# EAGLE design Thermister Expansion Module (EAGLE 9.6.2)

## Sheet 1 of 2
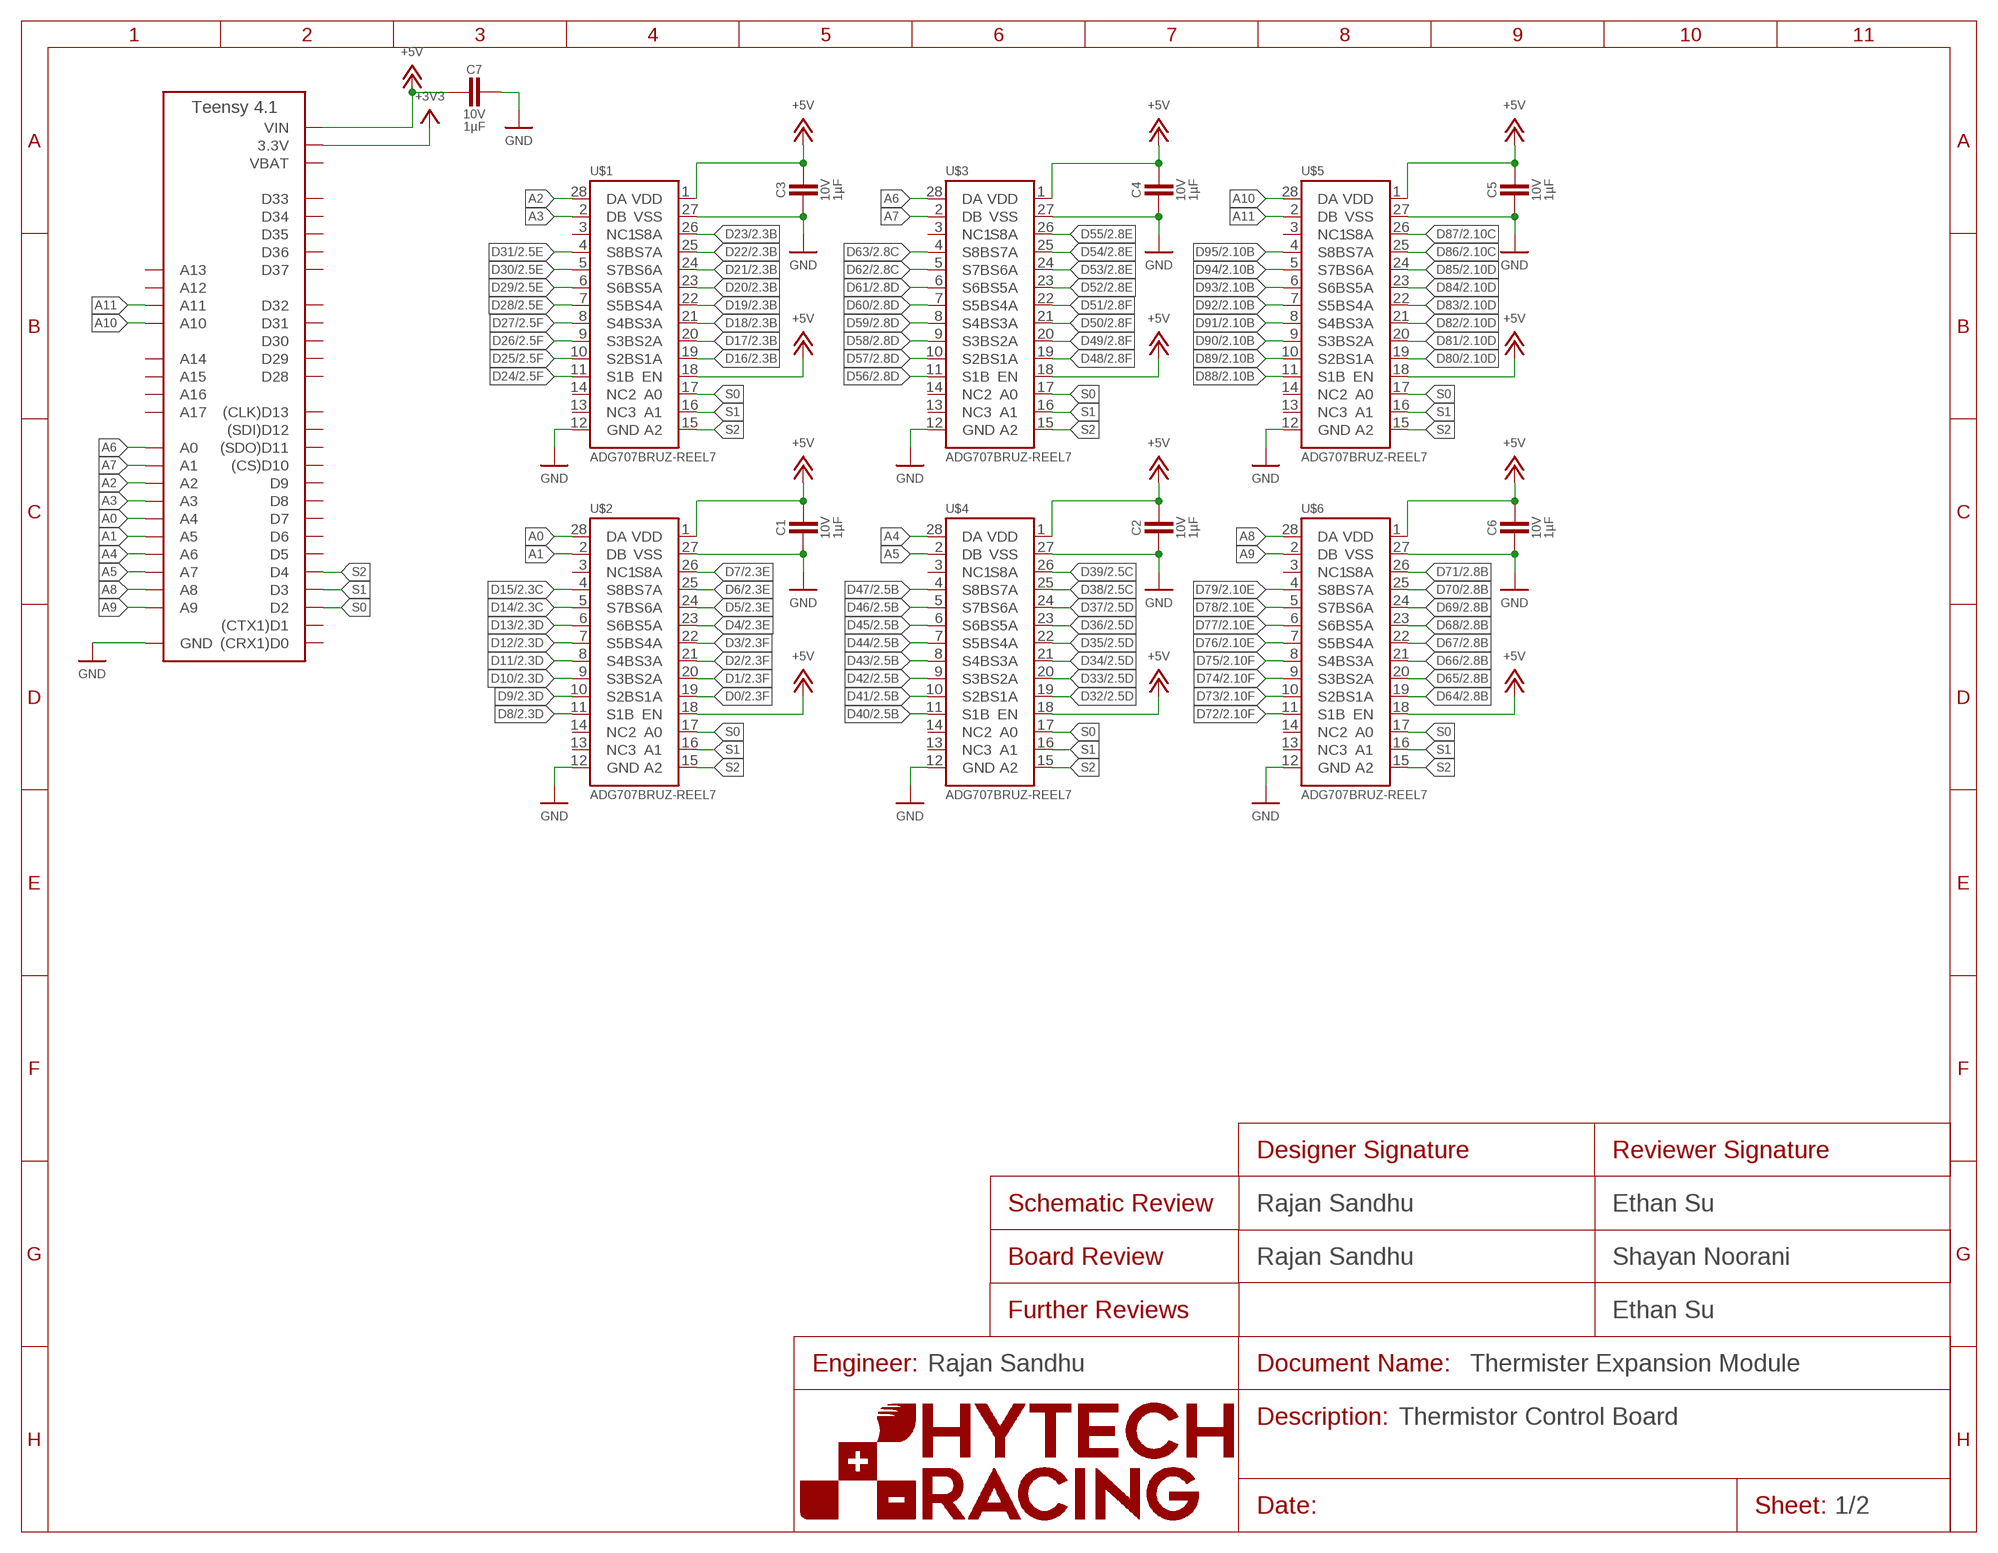
[diagram p0: schematic, sheet 1]
FRAME1 (FRAME): DESCRIPTION_1: Thermistor Control Board; DESIGNER_BOARD: Rajan Sandhu; DESIGNER_SCHEMATIC: Rajan Sandhu; ENGINEER: Rajan Sandhu; REVIEWER_BOARD: Shayan Noorani; REVIEWER_FURTHER: Ethan Su; REVIEWER_SCHEMATIC: Ethan Su

### Parts
A1  TEENSY_4.1  [TEENSY_LONG_EXT]
C1  CAPACITOR_0603_10V_1UF  [0603-CAP]
C2  CAPACITOR_0603_10V_1UF  [0603-CAP]
C3  CAPACITOR_0603_10V_1UF  [0603-CAP]
C4  CAPACITOR_0603_10V_1UF  [0603-CAP]
C5  CAPACITOR_0603_10V_1UF  [0603-CAP]
C6  CAPACITOR_0603_10V_1UF  [0603-CAP]
C7  CAPACITOR_0603_10V_1UF  [0603-CAP]
U$1  ADG707  [TSSOP-28]
U$2  ADG707  [TSSOP-28]
U$3  ADG707  [TSSOP-28]
U$4  ADG707  [TSSOP-28]
U$5  ADG707  [TSSOP-28]
U$6  ADG707  [TSSOP-28]

### Nets
+3V3: A1.3V3(3.3V) A1.3V3@2(3.3V) A1.3V3@3(3.3V) ; also sheet 2
+5V: A1.VIN C1.1 C2.1 C3.1 C4.1 C5.1 C6.1 C7.2 U$1.1(VDD) U$1.18(EN) U$2.1(VDD) U$2.18(EN) U$3.1(VDD) U$3.18(EN) U$4.1(VDD) U$4.18(EN) U$5.1(VDD) U$5.18(EN) U$6.1(VDD) U$6.18(EN) ; also sheet 2
A0: A1.D18(A4) U$2.28(DA)
A1: A1.D19(A5) U$2.2(DB)
A2: A1.D16(A2) U$1.28(DA)
A3: A1.D17(A3) U$1.2(DB)
A4: A1.D20(A6) U$4.28(DA)
A5: A1.D21(A7) U$4.2(DB)
A6: A1.D14(A0) U$3.28(DA)
A7: A1.D15(A1) U$3.2(DB)
A8: A1.D22(A8) U$6.28(DA)
A9: A1.D23(A9) U$6.2(DB)
A10: A1.D24(A10) U$5.28(DA)
A11: A1.D25(A11) U$5.2(DB)
D0: U$2.19(S1A) ; also sheet 2
D1: U$2.20(S2A) ; also sheet 2
D2: U$2.21(S3A) ; also sheet 2
D3: U$2.22(S4A) ; also sheet 2
D4: U$2.23(S5A) ; also sheet 2
D5: U$2.24(S6A) ; also sheet 2
D6: U$2.25(S7A) ; also sheet 2
D7: U$2.26(S8A) ; also sheet 2
D8: U$2.11(S1B) ; also sheet 2
D9: U$2.10(S2B) ; also sheet 2
D10: U$2.9(S3B) ; also sheet 2
D11: U$2.8(S4B) ; also sheet 2
D12: U$2.7(S5B) ; also sheet 2
D13: U$2.6(S6B) ; also sheet 2
D14: U$2.5(S7B) ; also sheet 2
D15: U$2.4(S8B) ; also sheet 2
D16: U$1.19(S1A) ; also sheet 2
D17: U$1.20(S2A) ; also sheet 2
D18: U$1.21(S3A) ; also sheet 2
D19: U$1.22(S4A) ; also sheet 2
D20: U$1.23(S5A) ; also sheet 2
D21: U$1.24(S6A) ; also sheet 2
D22: U$1.25(S7A) ; also sheet 2
D23: U$1.26(S8A) ; also sheet 2
D24: U$1.11(S1B) ; also sheet 2
D25: U$1.10(S2B) ; also sheet 2
D26: U$1.9(S3B) ; also sheet 2
D27: U$1.8(S4B) ; also sheet 2
D28: U$1.7(S5B) ; also sheet 2
D29: U$1.6(S6B) ; also sheet 2
D30: U$1.5(S7B) ; also sheet 2
D31: U$1.4(S8B) ; also sheet 2
D32: U$4.19(S1A) ; also sheet 2
D33: U$4.20(S2A) ; also sheet 2
D34: U$4.21(S3A) ; also sheet 2
D35: U$4.22(S4A) ; also sheet 2
D36: U$4.23(S5A) ; also sheet 2
D37: U$4.24(S6A) ; also sheet 2
D38: U$4.25(S7A) ; also sheet 2
D39: U$4.26(S8A) ; also sheet 2
D40: U$4.11(S1B) ; also sheet 2
D41: U$4.10(S2B) ; also sheet 2
D42: U$4.9(S3B) ; also sheet 2
D43: U$4.8(S4B) ; also sheet 2
D44: U$4.7(S5B) ; also sheet 2
D45: U$4.6(S6B) ; also sheet 2
D46: U$4.5(S7B) ; also sheet 2
D47: U$4.4(S8B) ; also sheet 2
D48: U$3.19(S1A) ; also sheet 2
D49: U$3.20(S2A) ; also sheet 2
D50: U$3.21(S3A) ; also sheet 2
D51: U$3.22(S4A) ; also sheet 2
D52: U$3.23(S5A) ; also sheet 2
D53: U$3.24(S6A) ; also sheet 2
D54: U$3.25(S7A) ; also sheet 2
D55: U$3.26(S8A) ; also sheet 2
D56: U$3.11(S1B) ; also sheet 2
D57: U$3.10(S2B) ; also sheet 2
D58: U$3.9(S3B) ; also sheet 2
D59: U$3.8(S4B) ; also sheet 2
D60: U$3.7(S5B) ; also sheet 2
D61: U$3.6(S6B) ; also sheet 2
D62: U$3.5(S7B) ; also sheet 2
D63: U$3.4(S8B) ; also sheet 2
D64: U$6.19(S1A) ; also sheet 2
D65: U$6.20(S2A) ; also sheet 2
D66: U$6.21(S3A) ; also sheet 2
D67: U$6.22(S4A) ; also sheet 2
D68: U$6.23(S5A) ; also sheet 2
D69: U$6.24(S6A) ; also sheet 2
D70: U$6.25(S7A) ; also sheet 2
D71: U$6.26(S8A) ; also sheet 2
D72: U$6.11(S1B) ; also sheet 2
D73: U$6.10(S2B) ; also sheet 2
D74: U$6.9(S3B) ; also sheet 2
D75: U$6.8(S4B) ; also sheet 2
D76: U$6.7(S5B) ; also sheet 2
D77: U$6.6(S6B) ; also sheet 2
D78: U$6.5(S7B) ; also sheet 2
D79: U$6.4(S8B) ; also sheet 2
D80: U$5.19(S1A) ; also sheet 2
D81: U$5.20(S2A) ; also sheet 2
D82: U$5.21(S3A) ; also sheet 2
D83: U$5.22(S4A) ; also sheet 2
D84: U$5.23(S5A) ; also sheet 2
D85: U$5.24(S6A) ; also sheet 2
D86: U$5.25(S7A) ; also sheet 2
D87: U$5.26(S8A) ; also sheet 2
D88: U$5.11(S1B) ; also sheet 2
D89: U$5.10(S2B) ; also sheet 2
D90: U$5.9(S3B) ; also sheet 2
D91: U$5.8(S4B) ; also sheet 2
D92: U$5.7(S5B) ; also sheet 2
D93: U$5.6(S6B) ; also sheet 2
D94: U$5.5(S7B) ; also sheet 2
D95: U$5.4(S8B) ; also sheet 2
GND: A1.AGND/GND(GND) A1.GND A1.GND@2(GND) C1.2 C2.2 C3.2 C4.2 C5.2 C6.2 C7.1 U$1.12(GND) U$1.27(VSS) U$2.12(GND) U$2.27(VSS) U$3.12(GND) U$3.27(VSS) U$4.12(GND) U$4.27(VSS) U$5.12(GND) U$5.27(VSS) U$6.12(GND) U$6.27(VSS) ; also sheet 2
S0: A1.D2 U$1.17(A0) U$2.17(A0) U$3.17(A0) U$4.17(A0) U$5.17(A0) U$6.17(A0)
S1: A1.D3 U$1.16(A1) U$2.16(A1) U$3.16(A1) U$4.16(A1) U$5.16(A1) U$6.16(A1)
S2: A1.D4 U$1.15(A2) U$2.15(A2) U$3.15(A2) U$4.15(A2) U$5.15(A2) U$6.15(A2)
Unconnected: A1.D0((CRX1)D0) A1.D1((CTX1)D1) A1.D5 A1.D6 A1.D7 A1.D8 A1.D9 A1.D10((CS)D10) A1.D11((SDO)D11) A1.D12((SDI)D12) A1.D13((CLK)D13) A1.D26(A12) A1.D27(A13) A1.D28 A1.D29 A1.D30 A1.D31 A1.D32 A1.D33 A1.D34 A1.D35 A1.D36 A1.D37 A1.D38(A14) A1.D39(A15) A1.D40(A16) A1.D41(A17) U$1.3(NC1) U$1.13(NC3) U$1.14(NC2) U$2.3(NC1) U$2.13(NC3) U$2.14(NC2) U$3.3(NC1) U$3.13(NC3) U$3.14(NC2) U$4.3(NC1) U$4.13(NC3) U$4.14(NC2) U$5.3(NC1) U$5.13(NC3) U$5.14(NC2) U$6.3(NC1) U$6.13(NC3) U$6.14(NC2)

## Sheet 2 of 2
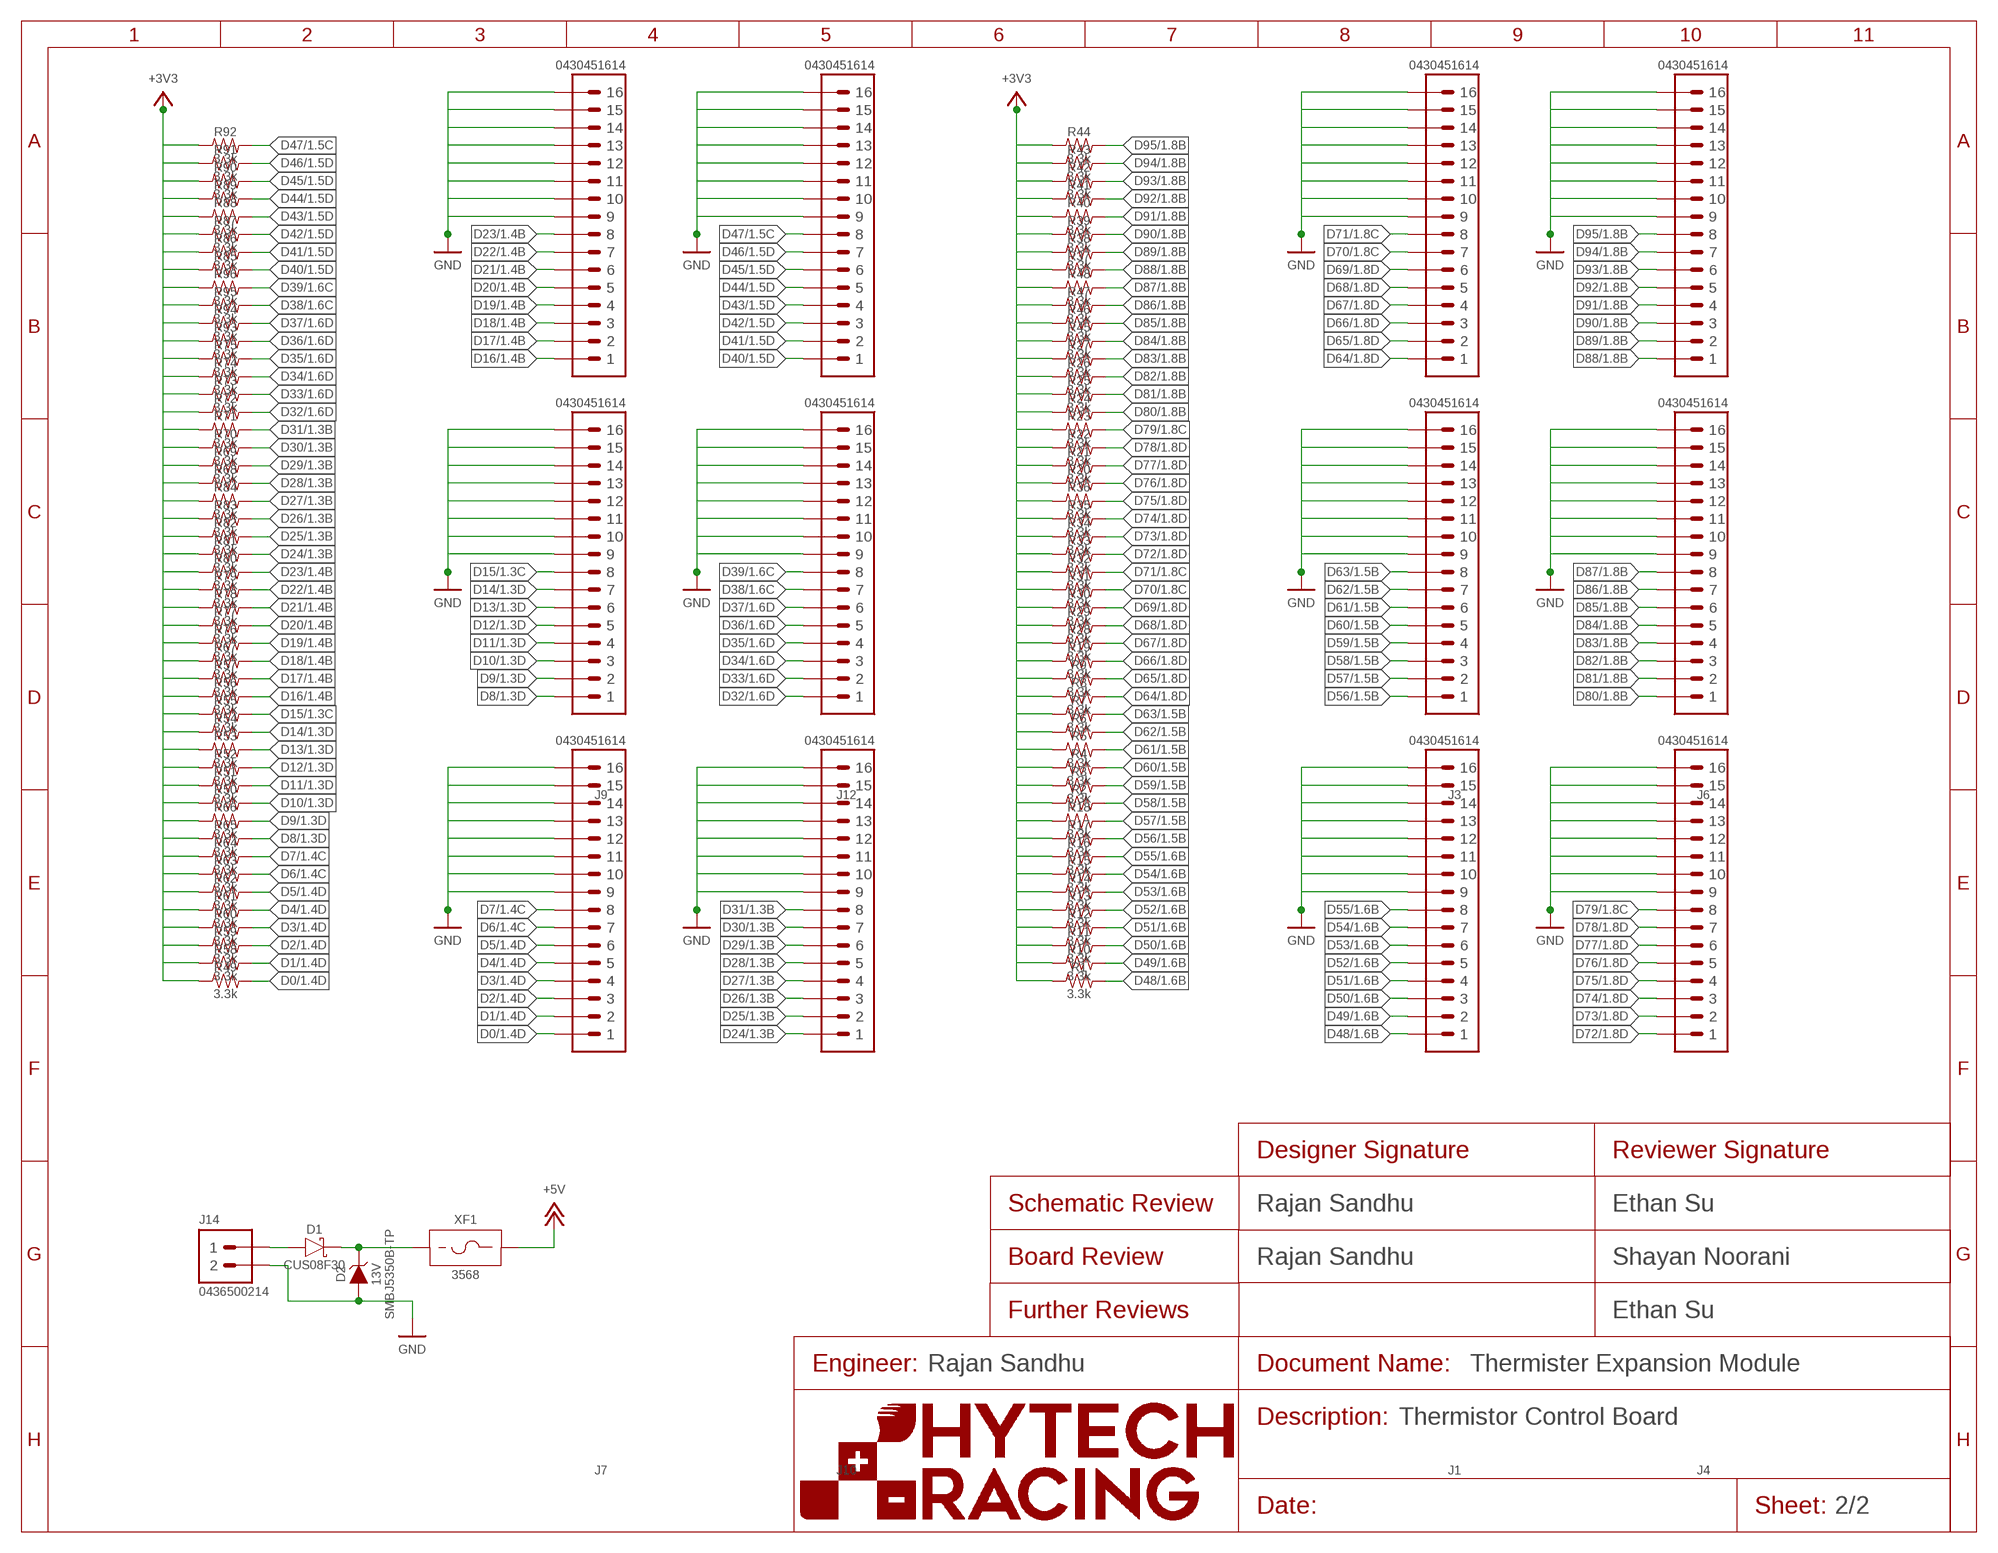
[diagram p1: schematic, sheet 2]
FRAME2 (FRAME): DESCRIPTION_1: Thermistor Control Board; DESIGNER_BOARD: Rajan Sandhu; DESIGNER_SCHEMATIC: Rajan Sandhu; ENGINEER: Rajan Sandhu; REVIEWER_BOARD: Shayan Noorani; REVIEWER_FURTHER: Ethan Su; REVIEWER_SCHEMATIC: Ethan Su

### Parts
D1  SCHOTTKY_SOD323_30V  [SOD-323]
D2  ZENER_SMB(DO-214AA)_13V  [SMB(DO-214AA)]
J1  CONNECTOR-16_MF_T_V_  [MOLEX_MICROFIT_PTH_VERTICAL_16_DUAL]
J2  CONNECTOR-16_MF_T_V_  [MOLEX_MICROFIT_PTH_VERTICAL_16_DUAL]
J3  CONNECTOR-16_MF_T_V_  [MOLEX_MICROFIT_PTH_VERTICAL_16_DUAL]
J4  CONNECTOR-16_MF_T_V_  [MOLEX_MICROFIT_PTH_VERTICAL_16_DUAL]
J5  CONNECTOR-16_MF_T_V_  [MOLEX_MICROFIT_PTH_VERTICAL_16_DUAL]
J6  CONNECTOR-16_MF_T_V_  [MOLEX_MICROFIT_PTH_VERTICAL_16_DUAL]
J7  CONNECTOR-16_MF_T_V_  [MOLEX_MICROFIT_PTH_VERTICAL_16_DUAL]
J8  CONNECTOR-16_MF_T_V_  [MOLEX_MICROFIT_PTH_VERTICAL_16_DUAL]
J9  CONNECTOR-16_MF_T_V_  [MOLEX_MICROFIT_PTH_VERTICAL_16_DUAL]
J10  CONNECTOR-16_MF_T_V_  [MOLEX_MICROFIT_PTH_VERTICAL_16_DUAL]
J11  CONNECTOR-16_MF_T_V_  [MOLEX_MICROFIT_PTH_VERTICAL_16_DUAL]
J12  CONNECTOR-16_MF_T_V_  [MOLEX_MICROFIT_PTH_VERTICAL_16_DUAL]
J14  CONNECTOR-2_MICROFIT_SMD_RIGHTANGLE_02_SINGLE_BLACK  [MOLEX_MICROFIT_SMD_RIGHTANGLE_02_SINGLE]
R1  RESISTOR_0603_3.3K  [0603-RES]
R2  RESISTOR_0603_3.3K  [0603-RES]
R3  RESISTOR_0603_3.3K  [0603-RES]
R4  RESISTOR_0603_3.3K  [0603-RES]
R5  RESISTOR_0603_3.3K  [0603-RES]
R6  RESISTOR_0603_3.3K  [0603-RES]
R7  RESISTOR_0603_3.3K  [0603-RES]
R8  RESISTOR_0603_3.3K  [0603-RES]
R9  RESISTOR_0603_3.3K  [0603-RES]
R10  RESISTOR_0603_3.3K  [0603-RES]
R11  RESISTOR_0603_3.3K  [0603-RES]
R12  RESISTOR_0603_3.3K  [0603-RES]
R13  RESISTOR_0603_3.3K  [0603-RES]
R14  RESISTOR_0603_3.3K  [0603-RES]
R15  RESISTOR_0603_3.3K  [0603-RES]
R16  RESISTOR_0603_3.3K  [0603-RES]
R17  RESISTOR_0603_3.3K  [0603-RES]
R18  RESISTOR_0603_3.3K  [0603-RES]
R19  RESISTOR_0603_3.3K  [0603-RES]
R20  RESISTOR_0603_3.3K  [0603-RES]
R21  RESISTOR_0603_3.3K  [0603-RES]
R22  RESISTOR_0603_3.3K  [0603-RES]
R23  RESISTOR_0603_3.3K  [0603-RES]
R24  RESISTOR_0603_3.3K  [0603-RES]
R25  RESISTOR_0603_3.3K  [0603-RES]
R26  RESISTOR_0603_3.3K  [0603-RES]
R27  RESISTOR_0603_3.3K  [0603-RES]
R28  RESISTOR_0603_3.3K  [0603-RES]
R29  RESISTOR_0603_3.3K  [0603-RES]
R30  RESISTOR_0603_3.3K  [0603-RES]
R31  RESISTOR_0603_3.3K  [0603-RES]
R32  RESISTOR_0603_3.3K  [0603-RES]
R33  RESISTOR_0603_3.3K  [0603-RES]
R34  RESISTOR_0603_3.3K  [0603-RES]
R35  RESISTOR_0603_3.3K  [0603-RES]
R36  RESISTOR_0603_3.3K  [0603-RES]
R37  RESISTOR_0603_3.3K  [0603-RES]
R38  RESISTOR_0603_3.3K  [0603-RES]
R39  RESISTOR_0603_3.3K  [0603-RES]
R40  RESISTOR_0603_3.3K  [0603-RES]
R41  RESISTOR_0603_3.3K  [0603-RES]
R42  RESISTOR_0603_3.3K  [0603-RES]
R43  RESISTOR_0603_3.3K  [0603-RES]
R44  RESISTOR_0603_3.3K  [0603-RES]
R45  RESISTOR_0603_3.3K  [0603-RES]
R46  RESISTOR_0603_3.3K  [0603-RES]
R47  RESISTOR_0603_3.3K  [0603-RES]
R48  RESISTOR_0603_3.3K  [0603-RES]
R49  RESISTOR_0603_3.3K  [0603-RES]
R50  RESISTOR_0603_3.3K  [0603-RES]
R51  RESISTOR_0603_3.3K  [0603-RES]
R52  RESISTOR_0603_3.3K  [0603-RES]
R53  RESISTOR_0603_3.3K  [0603-RES]
R54  RESISTOR_0603_3.3K  [0603-RES]
R55  RESISTOR_0603_3.3K  [0603-RES]
R56  RESISTOR_0603_3.3K  [0603-RES]
R57  RESISTOR_0603_3.3K  [0603-RES]
R58  RESISTOR_0603_3.3K  [0603-RES]
R59  RESISTOR_0603_3.3K  [0603-RES]
R60  RESISTOR_0603_3.3K  [0603-RES]
R61  RESISTOR_0603_3.3K  [0603-RES]
R62  RESISTOR_0603_3.3K  [0603-RES]
R63  RESISTOR_0603_3.3K  [0603-RES]
R64  RESISTOR_0603_3.3K  [0603-RES]
R65  RESISTOR_0603_3.3K  [0603-RES]
R66  RESISTOR_0603_3.3K  [0603-RES]
R67  RESISTOR_0603_3.3K  [0603-RES]
R68  RESISTOR_0603_3.3K  [0603-RES]
R69  RESISTOR_0603_3.3K  [0603-RES]
R70  RESISTOR_0603_3.3K  [0603-RES]
R71  RESISTOR_0603_3.3K  [0603-RES]
R72  RESISTOR_0603_3.3K  [0603-RES]
R73  RESISTOR_0603_3.3K  [0603-RES]
R74  RESISTOR_0603_3.3K  [0603-RES]
R75  RESISTOR_0603_3.3K  [0603-RES]
R76  RESISTOR_0603_3.3K  [0603-RES]
R77  RESISTOR_0603_3.3K  [0603-RES]
R78  RESISTOR_0603_3.3K  [0603-RES]
R79  RESISTOR_0603_3.3K  [0603-RES]
R80  RESISTOR_0603_3.3K  [0603-RES]
R81  RESISTOR_0603_3.3K  [0603-RES]
R82  RESISTOR_0603_3.3K  [0603-RES]
R83  RESISTOR_0603_3.3K  [0603-RES]
R84  RESISTOR_0603_3.3K  [0603-RES]
R85  RESISTOR_0603_3.3K  [0603-RES]
R86  RESISTOR_0603_3.3K  [0603-RES]
R87  RESISTOR_0603_3.3K  [0603-RES]
R88  RESISTOR_0603_3.3K  [0603-RES]
R89  RESISTOR_0603_3.3K  [0603-RES]
R90  RESISTOR_0603_3.3K  [0603-RES]
R91  RESISTOR_0603_3.3K  [0603-RES]
R92  RESISTOR_0603_3.3K  [0603-RES]
R93  RESISTOR_0603_3.3K  [0603-RES]
R94  RESISTOR_0603_3.3K  [0603-RES]
R95  RESISTOR_0603_3.3K  [0603-RES]
R96  RESISTOR_0603_3.3K  [0603-RES]
XF1  FUSE_HOLDER_MINIBLADEPTH  [3568]

### Nets
+3V3: R1.1 R2.1 R3.1 R4.1 R5.1 R6.1 R7.1 R8.1 R9.1 R10.1 R11.1 R12.1 R13.1 R14.1 R15.1 R16.1 R17.1 R18.1 R19.1 R20.1 R21.1 R22.1 R23.1 R24.1 R25.1 R26.1 R27.1 R28.1 R29.1 R30.1 R31.1 R32.1 R33.1 R34.1 R35.1 R36.1 R37.1 R38.1 R39.1 R40.1 R41.1 R42.1 R43.1 R44.1 R45.1 R46.1 R47.1 R48.1 R49.1 R50.1 R51.1 R52.1 R53.1 R54.1 R55.1 R56.1 R57.1 R58.1 R59.1 R60.1 R61.1 R62.1 R63.1 R64.1 R65.1 R66.1 R67.1 R68.1 R69.1 R70.1 R71.1 R72.1 R73.1 R74.1 R75.1 R76.1 R77.1 R78.1 R79.1 R80.1 R81.1 R82.1 R83.1 R84.1 R85.1 R86.1 R87.1 R88.1 R89.1 R90.1 R91.1 R92.1 R93.1 R94.1 R95.1 R96.1 ; also sheet 1
+5V: XF1.3 XF1.4 ; also sheet 1
D0: J7.1 R49.2 ; also sheet 1
D1: J7.2 R58.2 ; also sheet 1
D2: J7.3 R59.2 ; also sheet 1
D3: J7.4 R60.2 ; also sheet 1
D4: J7.5 R61.2 ; also sheet 1
D5: J7.6 R62.2 ; also sheet 1
D6: J7.7 R63.2 ; also sheet 1
D7: J7.8 R64.2 ; also sheet 1
D8: J8.1 R65.2 ; also sheet 1
D9: J8.2 R66.2 ; also sheet 1
D10: J8.3 R50.2 ; also sheet 1
D11: J8.4 R51.2 ; also sheet 1
D12: J8.5 R52.2 ; also sheet 1
D13: J8.6 R53.2 ; also sheet 1
D14: J8.7 R54.2 ; also sheet 1
D15: J8.8 R55.2 ; also sheet 1
D16: J9.1 R56.2 ; also sheet 1
D17: J9.2 R57.2 ; also sheet 1
D18: J9.3 R67.2 ; also sheet 1
D19: J9.4 R76.2 ; also sheet 1
D20: J9.5 R77.2 ; also sheet 1
D21: J9.6 R78.2 ; also sheet 1
D22: J9.7 R79.2 ; also sheet 1
D23: J9.8 R80.2 ; also sheet 1
D24: J10.1 R81.2 ; also sheet 1
D25: J10.2 R82.2 ; also sheet 1
D26: J10.3 R83.2 ; also sheet 1
D27: J10.4 R84.2 ; also sheet 1
D28: J10.5 R68.2 ; also sheet 1
D29: J10.6 R69.2 ; also sheet 1
D30: J10.7 R70.2 ; also sheet 1
D31: J10.8 R71.2 ; also sheet 1
D32: J11.1 R72.2 ; also sheet 1
D33: J11.2 R73.2 ; also sheet 1
D34: J11.3 R74.2 ; also sheet 1
D35: J11.4 R75.2 ; also sheet 1
D36: J11.5 R93.2 ; also sheet 1
D37: J11.6 R94.2 ; also sheet 1
D38: J11.7 R95.2 ; also sheet 1
D39: J11.8 R96.2 ; also sheet 1
D40: J12.1 R85.2 ; also sheet 1
D41: J12.2 R86.2 ; also sheet 1
D42: J12.3 R87.2 ; also sheet 1
D43: J12.4 R88.2 ; also sheet 1
D44: J12.5 R89.2 ; also sheet 1
D45: J12.6 R90.2 ; also sheet 1
D46: J12.7 R91.2 ; also sheet 1
D47: J12.8 R92.2 ; also sheet 1
D48: J1.1 R1.2 ; also sheet 1
D49: J1.2 R10.2 ; also sheet 1
D50: J1.3 R11.2 ; also sheet 1
D51: J1.4 R12.2 ; also sheet 1
D52: J1.5 R13.2 ; also sheet 1
D53: J1.6 R14.2 ; also sheet 1
D54: J1.7 R15.2 ; also sheet 1
D55: J1.8 R16.2 ; also sheet 1
D56: J2.1 R17.2 ; also sheet 1
D57: J2.2 R18.2 ; also sheet 1
D58: J2.3 R2.2 ; also sheet 1
D59: J2.4 R3.2 ; also sheet 1
D60: J2.5 R4.2 ; also sheet 1
D61: J2.6 R5.2 ; also sheet 1
D62: J2.7 R6.2 ; also sheet 1
D63: J2.8 R7.2 ; also sheet 1
D64: J3.1 R8.2 ; also sheet 1
D65: J3.2 R9.2 ; also sheet 1
D66: J3.3 R19.2 ; also sheet 1
D67: J3.4 R28.2 ; also sheet 1
D68: J3.5 R29.2 ; also sheet 1
D69: J3.6 R30.2 ; also sheet 1
D70: J3.7 R31.2 ; also sheet 1
D71: J3.8 R32.2 ; also sheet 1
D72: J4.1 R33.2 ; also sheet 1
D73: J4.2 R34.2 ; also sheet 1
D74: J4.3 R35.2 ; also sheet 1
D75: J4.4 R36.2 ; also sheet 1
D76: J4.5 R20.2 ; also sheet 1
D77: J4.6 R21.2 ; also sheet 1
D78: J4.7 R22.2 ; also sheet 1
D79: J4.8 R23.2 ; also sheet 1
D80: J5.1 R24.2 ; also sheet 1
D81: J5.2 R25.2 ; also sheet 1
D82: J5.3 R26.2 ; also sheet 1
D83: J5.4 R27.2 ; also sheet 1
D84: J5.5 R45.2 ; also sheet 1
D85: J5.6 R46.2 ; also sheet 1
D86: J5.7 R47.2 ; also sheet 1
D87: J5.8 R48.2 ; also sheet 1
D88: J6.1 R37.2 ; also sheet 1
D89: J6.2 R38.2 ; also sheet 1
D90: J6.3 R39.2 ; also sheet 1
D91: J6.4 R40.2 ; also sheet 1
D92: J6.5 R41.2 ; also sheet 1
D93: J6.6 R42.2 ; also sheet 1
D94: J6.7 R43.2 ; also sheet 1
D95: J6.8 R44.2 ; also sheet 1
GND: D2.A J1.9 J1.10 J1.11 J1.12 J1.13 J1.14 J1.15 J1.16 J2.9 J2.10 J2.11 J2.12 J2.13 J2.14 J2.15 J2.16 J3.9 J3.10 J3.11 J3.12 J3.13 J3.14 J3.15 J3.16 J4.9 J4.10 J4.11 J4.12 J4.13 J4.14 J4.15 J4.16 J5.9 J5.10 J5.11 J5.12 J5.13 J5.14 J5.15 J5.16 J6.9 J6.10 J6.11 J6.12 J6.13 J6.14 J6.15 J6.16 J7.9 J7.10 J7.11 J7.12 J7.13 J7.14 J7.15 J7.16 J8.9 J8.10 J8.11 J8.12 J8.13 J8.14 J8.15 J8.16 J9.9 J9.10 J9.11 J9.12 J9.13 J9.14 J9.15 J9.16 J10.9 J10.10 J10.11 J10.12 J10.13 J10.14 J10.15 J10.16 J11.9 J11.10 J11.11 J11.12 J11.13 J11.14 J11.15 J11.16 J12.9 J12.10 J12.11 J12.12 J12.13 J12.14 J12.15 J12.16 J14.2 ; also sheet 1
N$1: D1.A J14.1
N$3: D1.C D2.C XF1.1 XF1.2

## Power pins joined to a net without a drawn wire
VBAT: A1.VBAT

## Library data of the parts
A1 = HyTechDevices:TEENSY_4.1: Teensy 4.1 with VBAT Datasheet <https://www.pjrc.com/store/teensy41.html#pins> Requires ordering of: 2: 24 pin, 0.1" pitch female headers 1: 2 pin, 0.1" pitch female headers; TEENSY: 4.1
C1-C7 = HyTechDevices:CAPACITOR_?_*: Capacitor, Non-Polarized VJ...1BC Series Datasheet <https://www.mouser.com/datasheet/2/427/vjw1bcbascomseries-1762447.pdf> Samsung Datasheet <https://www.mouser.com/datasheet/2/585/MLCC-1837944.pdf> Samsung Automotive MLCC Datasheet <https://www.mouser.com/datasheet/2/585/MLCC_Automotive-1837966.pdf> Walsin Datasheet <https://www.mouser.com/datasheet/2/210/WTC_MLCC_General_Purpose-1534899.pdf> GRM188R61A226ME15D <https://www.mouser.com/datasheet/2/281/1/GRM188R61A226ME15_02A-1985787.pdf> GRM188R61E106MA73D <https://www.mouser.com/datasheet/2/281/1/GRM188R61E106MA73_01A-1985806.pdf> 885012006013 <https://www.mouser.com/datasheet/2/445/885012006013-1726946.pdf> 2220Y6300105KXTWS2 <https://www.mouser.com/datasheet/2/218/SMD_High_and_Std_StackiCap_P62-1825512.pdf> Yageo Class 2, X5R <https://www.mouser.com/datasheet/2/447/UPY_GPHC_X5R_4V_to_50V_26-1827097.pdf> TDK C Series <https://www.mouser.com/ProductDetail/TDK/C3216X5R1V226M160AC?qs=%2Fha2pyFadujbcx9jh7lYl%2F4NeMoXFhdc8AqVWNq4wW6M2y7zl6GzBuhgtI0ngznN> AVX Automotive MLCC <https://www.mouser.com/datasheet/2/40/AutoMLCC-777028.pdf> KEMET X7R Series <https://www.mouser.com/datasheet/2/212/KEM_C1002_X7R_SMD-1102033.pdf> Kyocera AVX <https://www.mouser.com/datasheet/2/40/C0GNP0_Dielectric-951274.pdf> GRM21BR61H <https://www.mouser.com/datasheet/2/281/1/GRM21BR61H106KE43_01A-1986884.pdf> C1812W104KDRACTU <https://www.mouser.com/datasheet/2/212/KEM_C1034_X7R_HV_ARC_SMD-1101730.pdf> CGA series - MLCC Automotive grade <https://product.tdk.com/system/files/dam/doc/product/capacitor/ceramic/mlcc/catalog/mlcc_automotive_general_en.pdf>; CAPACITANCE: 1µF; DKPN: 311-1796-1-ND; MANUFACTURER: Yageo; MOPN: 603-CC603KRX7R6BB105; MPN: CC0603KRX7R6BB105; TOLERANCE: 10%; VOLTAGE: 10V
D1 = HyTechDevices:SCHOTTKY_?_*: CUS08F30 Shottky Diode Datasheet <https://www.mouser.com/datasheet/2/408/CUS08F30_datasheet_en_20140414-1916097.pdf> CMDSH2-3 Shottky Diode Datasheet <https://www.mouser.com/datasheet/2/68/cmdsh2-3-39086.pdf> SD1206S040S2R0 Schottky Diode Datasheet <https://datasheets.kyocera-avx.com/schottky.pdf>; CURRENT: 0.8A; DKPN: CUS08F30H3FTR-ND; MANUFACTURER: Toshiba Semiconductor and Storage; MOPN: 757-CUS08F30H3F; MPN: CUS08F30; VOLTAGE: 30V
D2 = HyTechDevices:ZENER_?_*: Zener Diode 1SMB5949B-13 <https://www.diodes.com/assets/Datasheets/ds32125.pdf> SMBJ5350B-TP <https://www.mccsemi.com/pdf/Products/SMBJ5338B-SMBJ5388B(SMB).pdf>; CURRENT: 0.385A; DKPN: SMBJ5350B-TPMSCT-ND; MANUFACTURER: Micro Commercial Co; MOPN: 833-SMBJ5350B-TP; MPN: SMBJ5350B-TP; VOLTAGE: 13V
J1-J12 = HyTechDevices:CONNECTOR-16_?_*: 16 pin connector Datasheet <https://www.molex.com/webdocs/datasheets/pdf/en-us/0430451614_PCB_HEADERS.pdf>; DKPN: WM4718-ND; MANUFACTURER: MOLEX; MOPN: 538-43045-1614; MPN: 0430451614
J14 = HyTechDevices:CONNECTOR-2_?_*: 2 Pin Connector; DKPN: WM14310CT-ND; MANUFACTURER: Molex; MOPN: 538-43650-0214; MPN: 0436500214
R1-R96 = HyTechDevices:RESISTOR_?_*: Resistor PWR163 Series <https://www.mouser.com/datasheet/2/54/pwr163-777985.pdf> AC Series <https://www.mouser.com/datasheet/2/447/Yageo_PYu_AC_51_RoHS_L_7_1714230-1874691.pdf> PU Series <https://www.mouser.com/datasheet/2/447/PYu-PU_51_RoHS_L_6-1504619.pdf> UCR Series <https://fscdn.rohm.com/en/products/databook/datasheet/passive/resistor/chip_resistor/ucr-e.pdf> ERA Series <https://www.mouser.com/datasheet/2/315/AOA0000C307-1149632.pdf> PWR263 Series <https://www.mouser.com/datasheet/2/54/pwr263s_35-778069.pdf> KTR Series <https://www.mouser.com/datasheet/2/348/ROHM_S_A0011075115_1-2563276.pdf> RC Series <https://www.mouser.com/datasheet/2/447/Yageo_03_18_2021_PYu_RC_Group_51_RoHS_L_11-2199992.pdf> ERJ Low Resistance Series <https://www.mouser.com/datasheet/2/315/AOA0000C313-1141758.pdf> ERJ PB3, PB6 Series <https://www.mouser.com/datasheet/2/315/AOA0000C328-1530132.pdf> ERJ PA2, P03, PA3, P06, P08, P14 Series <https://www.mouser.com/datasheet/2/315/AOA0000C331-1141874.pdf> B20 Series <https://www.ohmite.com/assets/docs/res_200.pdf?r=false> TE Connectivity/Holsworthy RN73 Series <https://www.mouser.com/datasheet/2/418/4/NG_DS_1773270_M-604713.pdf> Vishay Dale D/CRCW e3 <https://www.mouser.com/datasheet/2/427/dcrcwe3-1762152.pdf> Ohmite B20 <https://www.ohmite.com/assets/docs/res_200.pdf?r=false>; DKPN: P20340TR-ND; MANUFACTURER: Panasonic Electronic Components; MOPN: 667-ERJ-PB3D3301V; MPN: ERJ-PB3D3301V; POWER: 0.3W; RESISTANCE: 3.3k; TOLERANCE: 0.5%; VOLTAGE_CONTINUOUS: 25.69V; VOLTAGE_MAX: 150
U$1-U$6 = HyTechDevices:ADG707: ADG707 2 Analog 8:1 Multiplexer Datasheet <https://www.analog.com/media/en/technical-documentation/data-sheets/ADG706_707.pdf>; DKPN: ADG707BRUZ-REEL7CT-ND; MANUFACTURER: Analog Devices Inc.; MOPN: 584-ADG707BRUZ-R7; MPN: ADG707BRUZ-REEL7
XF1 = HyTechDevices:FUSE_HOLDER_*: Fuse Holder All PNs for the holder; if Miniblade Fuses <https://www.littelfuse.com/media?resourcetype=datasheets&itemid=0f5f58cb-559e-494b-8d53-723f30445ae5&filename=littelfuse-mini-datasheet> needed, order separately. Mini-Blade PTH <https://www.mouser.com/datasheet/2/215/3568-742601.pdf> Mini-Blade SMD <https://www.mouser.com/datasheet/2/215/588-744913.pdf> Littelfuse 122 Fuse Holder and Fuse Fuse <https://www.littelfuse.com/~/media/electronics/datasheets/fuses/littelfuse_fuse_508_datasheet.pdf.pdf> Fuse Holder <https://www.littelfuse.com/~/media/electronics/datasheets/fuse_clips/littelfuse_fuse_clip_102_122_datasheet.pdf.pdf>; DKPN: 36-3568-ND; FUSE_TYPE: MINI 297; MANUFACTURER: Keystone; MOPN: 534-3568; MPN: 3568

## Board
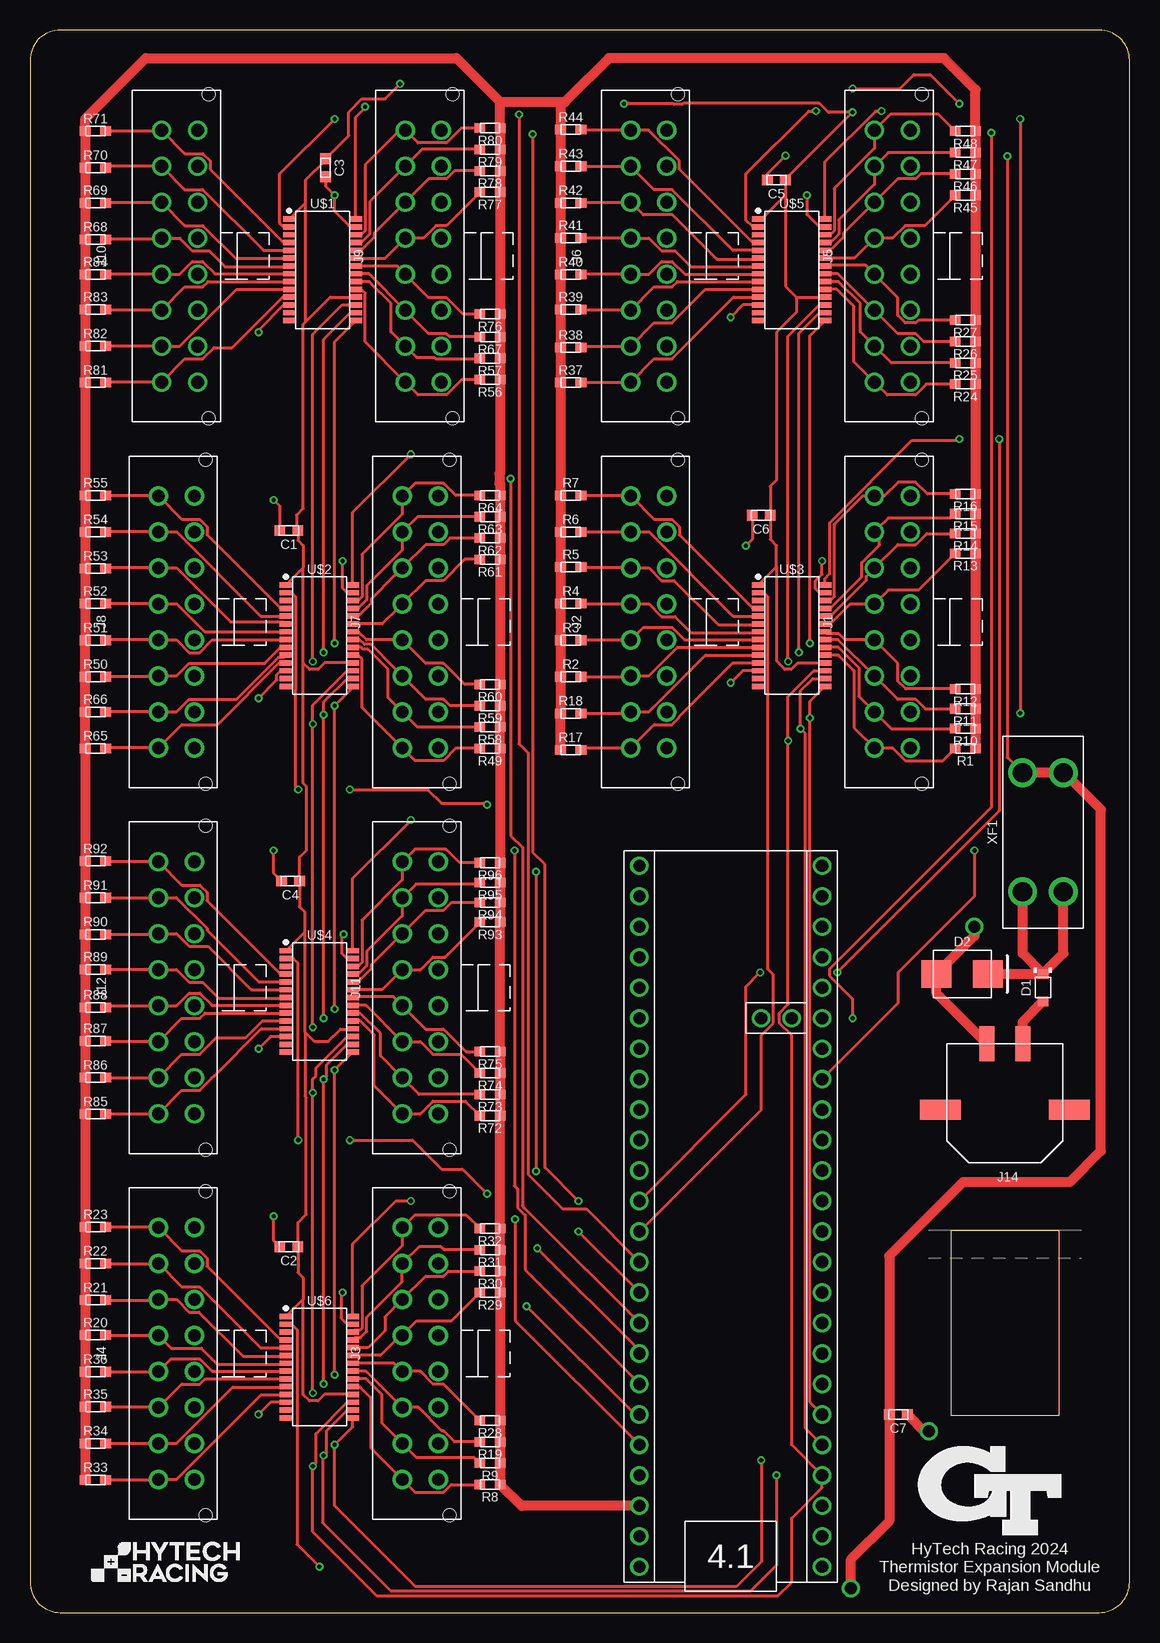
[diagram p2: board, top side]
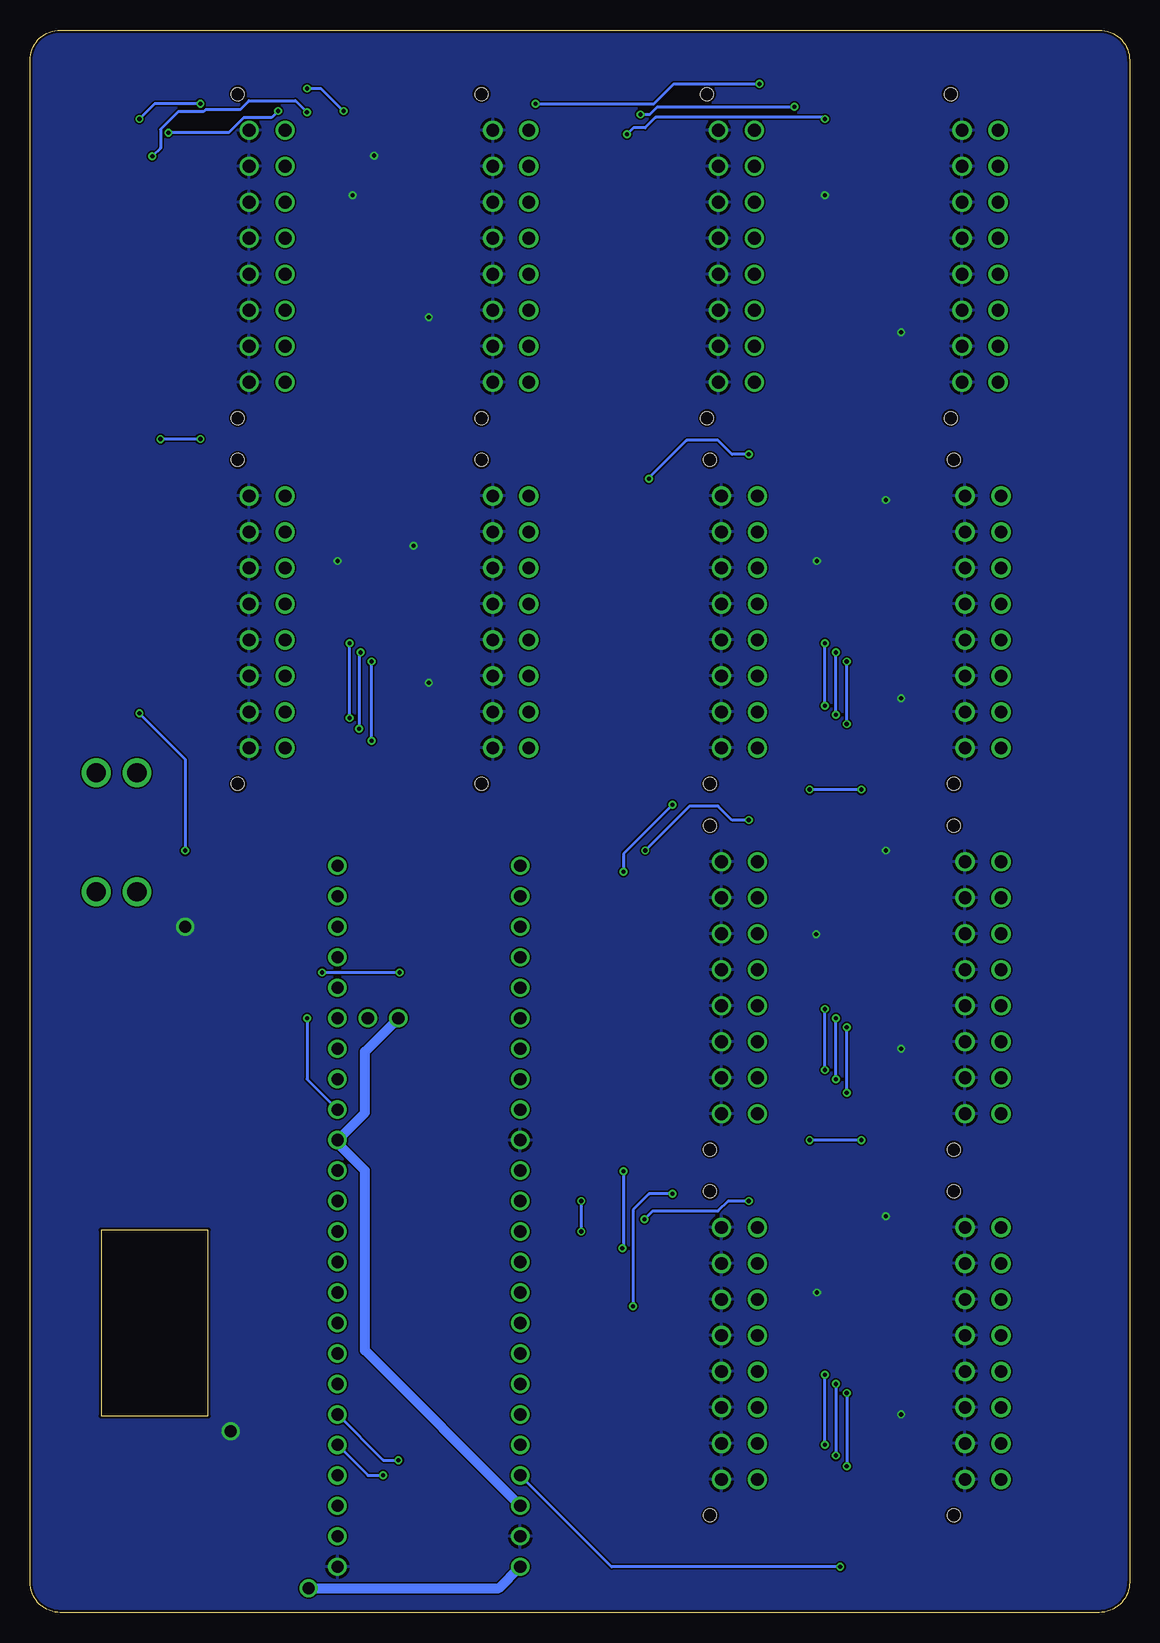
[diagram p3: board, bottom side, seen from below]

Size 91.67 x 131.88 mm. Coordinates in mm from the lower left corner, seen from the top.
Outline: 89.13,131.88 2.54,131.88 arc90 0,129.34 0,2.54 arc90 2.54,0 89.13,0 arc90 91.67,2.54 91.67,129.34 arc90 89.13,131.88
Copper layers (1*16): Top 0.035mm / dielectric 1.53mm / Bottom 0.035mm
Design rules "JLCPCB (2 Layer)": minimum track width 5mil, minimum drill 0.3mm, track to track 5mil, track to pad 5mil, pad to pad 5mil, via to via 20mil, smd to smd 5mil, copper to edge 0.2mm, drill to drill 21mil, minimum pad ring 6mil, minimum via ring 6mil, stop-mask expansion 6mil, vias tented up to drill 30mil, thermal gap 10mil

### Footprints (pad centres in the part's own frame; a part is rotated, then mirrored left to right if it is on the bottom)
TEENSY_LONG_EXT = drill 1.016: 3V3 0,5.08; 3V3@2 15.24,35.56; 3V3@3 10.16,45.72; AGND/GND 0,2.54; D0 15.24,2.54; D1 15.24,5.08; D2 15.24,7.62; D3 15.24,10.16; D4 15.24,12.7; D5 15.24,15.24; D6 15.24,17.78; D7 15.24,20.32; D8 15.24,22.86; D9 15.24,25.4; D10 15.24,27.94; D11 15.24,30.48; D12 15.24,33.02; D13 0,33.02; D14 0,30.48; D15 0,27.94; D16 0,25.4; D17 0,22.86; D18 0,20.32; D19 0,17.78; D20 0,15.24; D21 0,12.7; D22 0,10.16; D23 0,7.62; D24 15.24,38.1; D25 15.24,40.64; D26 15.24,43.18; D27 15.24,45.72; D28 15.24,48.26; D29 15.24,50.8; D30 15.24,53.34; D31 15.24,55.88; D32 15.24,58.42; D33 0,58.42; D34 0,55.88; D35 0,53.34; D36 0,50.8; D37 0,48.26; D38 0,45.72; D39 0,43.18; D40 0,40.64; D41 0,38.1; GND 15.24,0; GND@2 0,35.56; VBAT 12.7,45.72; VIN 0,0
0603-CAP = smd 0.9 x 0.9: 1 -0.75,0; 2 0.75,0
SOD-323 = smd 0.8 x 0.9: A -1.15,0; C 1.15,0
SMB(DO-214AA) = smd 2.5 x 2.3: A -2.15,0; C 2.15,0
MOLEX_MICROFIT_PTH_VERTICAL_16_DUAL = drill 1.067: 1 10.5,-3; 2 7.5,-3; 3 4.5,-3; 4 1.5,-3; 5 -1.5,-3; 6 -4.5,-3; 7 -7.5,-3; 8 -10.5,-3; 9 10.5,0; 10 7.5,0; 11 4.5,0; 12 1.5,0; 13 -1.5,0; 14 -4.5,0; 15 -7.5,0; 16 -10.5,0 | hole 1.067: 13.5,0.94; -13.5,0.94
MOLEX_MICROFIT_SMD_RIGHTANGLE_02_SINGLE = smd 1.27 x 2.921: 1 1.499,5.474; 2 -1.499,5.474 | smd 3.429 x 1.651: PAD1 5.372,0; PAD2 -5.372,0
0603-RES = smd 0.9 x 0.8: 1 -0.85,0; 2 0.85,0
TSSOP-28 = smd 0.45 x 1.05: 1 -4.225,-2.775; 2 -3.575,-2.775; 3 -2.925,-2.775; 4 -2.275,-2.775; 5 -1.625,-2.775; 6 -0.975,-2.775; 7 -0.325,-2.775; 8 0.325,-2.775; 9 0.975,-2.775; 10 1.625,-2.775; 11 2.275,-2.775; 12 2.925,-2.775; 13 3.575,-2.775; 14 4.225,-2.775; 15 4.225,2.775; 16 3.575,2.775; 17 2.925,2.775; 18 2.275,2.775; 19 1.625,2.775; 20 0.975,2.775; 21 0.325,2.775; 22 -0.325,2.775; 23 -0.975,2.775; 24 -1.625,2.775; 25 -2.275,2.775; 26 -2.925,2.775; 27 -3.575,2.775; 28 -4.225,2.775
3568 = drill 1.6: 1 -4.953,1.702; 2 -4.953,-1.702; 3 4.953,-1.702; 4 4.953,1.702

### Placement (x,y rotation side)
A1  50.8,3.81 0 top
C1  21.59,90.17 180 top
C2  21.59,30.48 180 top
C3  24.64,120.4 270 top
C4  21.72,60.96 180 top
C5  62.23,119.38 180 top
C6  60.96,91.44 180 top
C7  72.39,16.51 180 top
D1  84.45,52.07 90 top
D2  77.72,53.21 0 top
J1  73.41,82.55 270 top
J2  53.09,82.55 270 top
J3  34.04,21.59 270 top
J4  13.72,21.59 270 top
J5  73.41,113.03 270 top
J6  53.09,113.03 270 top
J7  34.04,82.55 270 top
J8  13.72,82.55 270 top
J9  34.29,113.03 270 top
J10  13.97,113.03 270 top
J11  34.04,52.07 270 top
J12  13.72,52.07 270 top
J14  81.28,41.91 0 top
R1  77.98,72.01 180 top
R2  45.09,77.98 0 top
R3  45.09,81.03 0 top
R4  45.09,84.07 0 top
R5  45.09,87.12 0 top
R6  45.09,90.04 0 top
R7  45.09,93.09 0 top
R8  38.35,10.67 180 top
R9  38.35,12.45 180 top
R10  77.98,73.66 180 top
R11  77.98,75.31 180 top
R12  77.98,76.96 180 top
R13  77.98,88.27 180 top
R14  77.98,89.92 180 top
R15  77.98,91.57 180 top
R16  77.98,93.22 180 top
R17  45.09,71.88 0 top
R18  45.09,74.93 0 top
R19  38.35,14.22 180 top
R20  5.46,23.11 0 top
R21  5.46,26.04 0 top
R22  5.46,29.08 0 top
R23  5.46,32.13 0 top
R24  77.98,102.36 180 top
R25  77.98,104.14 180 top
R26  77.98,105.92 180 top
R27  77.98,107.7 180 top
R28  38.35,16 180 top
R29  38.35,26.67 180 top
R30  38.35,28.45 180 top
R31  38.35,30.23 180 top
R32  38.35,32 180 top
R33  5.46,11.05 0 top
R34  5.46,14.1 0 top
R35  5.46,17.14 0 top
R36  5.46,20.07 0 top
R37  45.09,102.49 0 top
R38  45.09,105.41 0 top
R39  45.09,108.58 0 top
R40  45.09,111.51 0 top
R41  45.09,114.55 0 top
R42  45.09,117.47 0 top
R43  45.09,120.52 0 top
R44  45.09,123.57 0 top
R45  77.98,118.11 180 top
R46  77.98,119.89 180 top
R47  77.98,121.67 180 top
R48  77.98,123.44 180 top
R49  38.35,72.01 180 top
R50  5.46,77.98 0 top
R51  5.46,81.03 0 top
R52  5.46,84.07 0 top
R53  5.46,87 0 top
R54  5.46,90.04 0 top
R55  5.46,93.09 0 top
R56  38.35,102.74 180 top
R57  38.35,104.52 180 top
R58  38.35,73.79 180 top
R59  38.35,75.56 180 top
R60  38.35,77.34 180 top
R61  38.35,87.76 180 top
R62  38.35,89.53 180 top
R63  38.35,91.31 180 top
R64  38.35,93.09 180 top
R65  5.46,72.01 0 top
R66  5.46,75.06 0 top
R67  38.35,106.3 180 top
R68  5.46,114.43 0 top
R69  5.46,117.47 0 top
R70  5.46,120.4 0 top
R71  5.46,123.44 0 top
R72  38.35,41.4 180 top
R73  38.35,43.18 180 top
R74  38.35,44.96 180 top
R75  38.35,46.74 180 top
R76  38.35,108.2 180 top
R77  38.35,118.36 180 top
R78  38.35,120.14 180 top
R79  38.35,121.92 180 top
R80  38.35,123.7 180 top
R81  5.46,102.49 0 top
R82  5.46,105.54 0 top
R83  5.46,108.58 0 top
R84  5.46,111.51 0 top
R85  5.46,41.53 0 top
R86  5.46,44.58 0 top
R87  5.46,47.62 0 top
R88  5.46,50.42 0 top
R89  5.46,53.59 0 top
R90  5.46,56.52 0 top
R91  5.46,59.56 0 top
R92  5.46,62.61 0 top
R93  38.35,57.53 180 top
R94  38.35,59.18 180 top
R95  38.35,60.83 180 top
R96  38.35,62.48 180 top
U$1  24.38,111.89 270 top
U$2  24.13,81.41 270 top
U$3  63.5,81.41 270 top
U$4  24.13,50.93 270 top
U$5  63.5,111.89 270 top
U$6  24.13,20.45 270 top
U$7  [LOGO_GT_MEDIUM]  80.01,10.16 0 top
U$8  [LOGO_HYTECH_SMALL]  5.08,2.54 0 top
XF1  84.45,65.02 90 top

### Tracks (layer width: path | path; a pad name or v marks a point on that pad's centre or on a via)
+3V3
  Top 0.813: R1.1 R10.1 R11.1 R12.1 R13.1 R14.1 R15.1 R16.1 R24.1 R25.1 R26.1 R27.1 R45.1 R46.1 R47.1 R48.1 78.83,126.91 76.2,129.54 48.26,129.54 44.87,126.15 44.62,125.9 | R33.1 R34.1 R35.1 R36.1 R20.1 R21.1 R22.1 R23.1 R85.1 R86.1 R87.1 R88.1 R89.1 R90.1 R91.1 R92.1 R65.1 R66.1 R50.1 R51.1 R52.1 R53.1 R54.1 R55.1 R81.1 R82.1 R83.1 R84.1 R68.1 R69.1 R70.1 R71.1 4.61,124.5 9.65,129.54 35.56,129.54 39.2,125.9 | 44.62,125.9 44.23,125.52 R44.1 R43.1 R42.1 R41.1 R40.1 R39.1 R38.1 R37.1 R7.1 R6.1 R5.1 R4.1 R3.1 R2.1 R18.1 R17.1 | A1.3V3 40.98,8.89 R8.1 R9.1 R19.1 R28.1 R29.1 R30.1 R31.1 R32.1 R72.1 R73.1 R74.1 R75.1 R93.1 R94.1 R95.1 R96.1 R49.1 R58.1 R59.1 R60.1 R61.1 R62.1 R63.1 R64.1 39.2,94.02 39.13,94.1 39.13,94.88 39.2,94.95 R56.1 R57.1 R67.1 R76.1 R77.1 R78.1 R79.1 R80.1 39.2,125.9 | 39.2,125.9 44.62,125.9
  Bottom 0.813: A1.3V3@3 63.75,46.74 63.75,41.66 A1.3V3@2 66.04,39.12 63.75,36.83 63.75,21.84 A1.3V3
+5V  (via drill 0.36, 1)
  Top 0.254: 62.23,87.14 62.23,79.29 62.93,78.59 63.48,78.59 64.02,79.13 U$3.18 | 63.89,109.61 U$5.18 | 86.23,69.98 XF1.3 | U$6.18 24.54,18.17 24,17.63 23.31,17.63 22.78,18.16 22.78,26.1 | 22.79,79.11 22.79,69.09 23.03,68.85 23.03,63.5 22.47,62.94 C4.1 22.47,58.81 22.93,58.35 22.93,56.72 | 22.79,79.11 22.79,87.07 | 22.98,107.56 22.79,107.37 22.79,92.01 22.23,91.44 22.23,90.28 C1.1 22.34,89.35 22.79,88.9 22.79,87.07 | 22.79,79.11 23.31,78.59 24,78.59 24.54,79.13 U$2.18 | 22.93,48.37 22.93,56.72 | 22.93,48.37 22.93,43.03 23.03,42.93 23.03,33.19 22.34,32.5 C2.1 22.34,28.33 22.78,27.89 22.78,26.1 | U$4.18 26.88,48.62 25.89,48.62 24.87,47.6 23.69,47.6 22.93,48.37 | 22.98,107.56 22.98,117.48 | 22.98,117.48 22.98,119.38 24.64,121.04 C3.1 26.57,123.07 26.57,125.04 27.67,126.14 29.62,126.14 v30.86,127.38 | v49.53,125.73 53.61,125.73 53.67,125.67 54.38,125.67 54.49,125.78 65.8,125.78 66.56,125.02 v68.58,125.02 62.98,119.42 C5.1 62.98,118.11 | v81.47,121.35 81.47,71.26 XF1.4 | U$1.18 25.03,109.61 22.98,107.56 | U$1.1 22.98,117.48 | U$2.1 22.79,87.07 | U$4.1 22.93,56.72 | U$6.1 22.78,26.1 | 62.98,118.11 62.98,110.52 63.89,109.61 | 63.89,109.61 63.89,108.34 62.23,106.68 62.23,94.36 61.71,93.84 C6.1 61.71,89.42 62.23,88.9 62.23,87.14 | 62.98,118.11 60.98,116.11 U$5.1 | U$3.1 62.23,87.14
  Top 0.813: XF1.3 XF1.4 | 86.23,69.98 89.28,66.93 89.28,38.48 86.67,35.87 77.78,35.87 71.64,29.73 C7.2 71.64,7.62 68.45,4.43 v68.45,2.03
  Bottom 0.254: v49.53,125.73 39.66,125.73 37.99,127.39 34.87,127.39 34.86,127.38 v30.86,127.38 | v81.47,121.35 80.8,122.03 80.8,123.59 79.31,125.07 77.2,125.07 77,125.27 74.12,125.27 73.41,125.98 69.54,125.98 v68.58,125.02
  Bottom 0.813: v68.45,2.03 52.58,2.03 A1.VIN
A0  (via drill 0.35)
  Top 0.254: U$2.28 26.91,91.67 v31.75,96.52 | A1.D18 41.91,33.02 41.25,33.68 41.04,33.89 41.04,63.77 40.06,64.75 v40.06,94.49
  Bottom 0.254: v31.75,96.52 33.15,96.52 34.3,97.68 36.94,97.68 40.06,94.56 v40.06,94.49
A1  (via drill 0.35)
  Top 0.254: v22.37,68.58 22.11,68.84 22.11,76.83 22.13,76.85 22.13,84.66 21.81,84.98 U$2.2 | v26.67,68.58 33.15,68.58 34.3,67.42 37.99,67.42 v38.1,67.31 | v42.19,61.72 v42.19,36.78 | v42.29,30.35 50.8,21.84 A1.D19
  Bottom 0.254: v22.37,68.58 v26.67,68.58 | v38.1,67.31 42.19,63.22 v42.19,61.72 | v42.19,36.78 42.19,30.46 v42.29,30.35
A2  (via drill 0.35, 0.36)
  Top 0.254: U$1.28 27.16,124.61 27.94,125.39 v27.94,125.48 | v40.77,124.84 40.77,72.39 41.53,71.63 41.53,36.5 44.4,33.63 46.38,33.63 A1.D16
  Bottom 0.254: v40.77,124.84 40.01,124.84 39.37,125.48 v27.94,125.48
A3  (via drill 0.35, 0.36)
  Top 0.254: v45.72,34.29 42.92,37.09 42.92,62.35 41.91,63.37 v41.91,123.19 | v45.72,31.75 A1.D17 | U$1.2 21.15,115.46 20.83,115.78 20.83,119.89 v25.4,124.46
  Bottom 0.254: v41.91,123.19 41.37,123.73 40.39,123.73 39.52,124.6 25.54,124.6 v25.4,124.46 | v45.72,34.29 v45.72,31.75
A4  (via drill 0.35)
  Top 0.254: U$4.28 26.91,61.2 v31.75,66.04 | A1.D20 41.27,28.57 41.27,33.12 40.66,33.73 40.66,35.28 40.64,35.31 40.51,35.43 40.39,35.56 v40.39,63.5
  Bottom 0.254: v31.75,66.04 33.15,66.04 34.3,67.2 36.69,67.2 v40.39,63.5
A5  (via drill 0.35)
  Top 0.254: v26.67,39.37 31.88,39.37 34.3,36.94 36.05,36.94 v38.1,34.9 | v41.4,25.53 50.42,16.51 A1.D21 | U$4.2 21.95,54.5 22.34,54.12 22.34,39.4 v22.37,39.37
  Bottom 0.254: v38.1,34.9 40.06,34.9 41.4,33.56 v41.4,25.53 | v22.37,39.37 v26.67,39.37
A6  (via drill 0.35, 0.36)
  Top 0.254: v77.47,97.79 77.36,97.68 73.54,97.68 66.7,90.83 66.7,86.59 66.28,86.17 U$3.28 | A1.D14 59.69,43.18 59.69,52.16 v60.87,53.34 | v80.8,97.79 80.8,66.83 v67.31,53.34
  Bottom 0.254: v67.31,53.34 v60.87,53.34 | v77.47,97.79 v80.8,97.79
A7
  Top 0.254: A1.D15 60.96,41.91 60.96,48.09 61.98,49.11 61.98,53.17 61.53,53.61 61.53,84.64 61.18,84.98 U$3.2
A8  (via drill 0.35)
  Top 0.254: U$6.28 26.91,30.71 30.48,34.29 v31.75,34.29 | A1.D22 40.45,24.32 v40.45,32.77
  Bottom 0.254: v31.75,34.29 33.48,34.29 34.3,33.46 39.75,33.46 v40.45,32.77
A9  (via drill 0.36)
  Top 0.254: U$6.2 21.4,23.98 21.86,23.98 22.26,23.57 22.26,5.68 v24.13,3.81
  Bottom 0.254: A1.D23 43.18,3.81 v24.13,3.81
A10  (via drill 0.35)
  Top 0.254: v68.58,49.53 68.58,51.14 66.65,53.07 66.65,53.61 80.14,67.1 v80.14,123.32 | v70.99,125.12 70.51,125.12 66.28,120.89 U$5.28
  Bottom 0.254: v68.58,49.53 68.58,44.45 A1.D24 | v70.99,125.12 71.53,124.58 73.84,124.58 75.11,123.32 v80.14,123.32
A11  (via drill 0.35, 0.36)
  Top 0.254: v68.58,127 72.52,127 73.67,128.16 75.04,128.16 v77.47,125.73 | U$5.2 60.27,115.46 59.69,116.04 59.69,119.89 64.92,125.12 v65.53,125.12 | v82.55,124.46 v82.55,74.93 | A1.D25 72.39,50.8 72.39,53.34 78.74,59.69 v78.74,63.5
  Bottom 0.254: v65.53,125.12 67.41,127 v68.58,127 | v77.47,125.73 81.28,125.73 v82.55,124.46 | v82.55,74.93 78.74,71.12 v78.74,63.5
D0
  Top 0.254: U$2.19 27.36,79.78 27.68,79.46 27.68,75.4 J7.1 32.09,71 34.47,71 35.49,72.01 R49.2
D1
  Top 0.254: U$2.20 27.59,80.43 27.73,80.29 28.17,80.29 29.84,78.61 29.84,76.24 30.82,75.27 J7.2 32.3,73.79 R58.2
D2
  Top 0.254: U$2.21 27.48,81.08 27.89,80.67 28.42,80.67 30.41,78.67 J7.3 32.98,76.1 34.47,76.1 35.01,75.56 R59.2
D3
  Top 0.254: U$2.22 27.36,81.73 28.05,81.05 J7.4 32.98,79.1 34.47,79.1 36.23,77.34 R60.2
D4
  Top 0.254: U$2.23 29.37,82.38 30.64,83.66 J7.5 32.98,86 34.47,86 36.23,87.76 R61.2
D5
  Top 0.254: U$2.24 27.36,83.03 28.45,84.11 28.45,84.46 30.41,86.43 J7.6 32.98,89 34.47,89 35.01,89.53 R62.2
D6
  Top 0.254: U$2.25 27.36,83.68 28.07,84.38 28.07,85.57 31.04,88.54 J7.7 32.3,91.31 R63.2
D7
  Top 0.254: U$2.26 27.36,84.33 27.68,84.65 27.68,88.19 31.04,91.54 J7.8 32.09,94.1 34.47,94.1 35.49,93.09 R64.2
D8
  Top 0.254: R65.2 6.35,72.05 J8.1 12.66,74 15.65,74 20.79,79.13 U$2.11
D9
  Top 0.254: R66.2 J8.2 12.22,75.05 13.28,76.1 17.22,76.1 20.73,79.61 21.18,79.61 U$2.10
D10
  Top 0.254: R50.2 10.64,77.98 J8.3 12.22,78.05 13.28,79.1 19.57,79.1 20.9,80.43 U$2.9
D11
  Top 0.254: R51.2 6.33,81.05 J8.4 12.22,81.05 13.28,80 14.15,80 15.21,81.05 21.32,81.05 U$2.8
D12
  Top 0.254: R52.2 6.33,84.05 J8.5 12.22,84.05 14.54,81.73 U$2.7
D13
  Top 0.254: R53.2 6.37,87.05 J8.6 12.22,87.05 16.72,82.55 21.18,82.55 U$2.6
D14
  Top 0.254: R54.2 J8.7 12.22,90.05 19.24,83.03 U$2.5
D15
  Top 0.254: R55.2 6.35,93.05 J8.8 12.66,91.1 14.15,91.1 14.77,90.49 14.77,89.81 20.9,83.68 U$2.4
D16
  Top 0.254: R56.2 35.99,102.74 34.73,101.48 32.34,101.48 J9.1 27.94,105.88 27.94,109.94 27.62,110.26 U$1.19
D17
  Top 0.254: U$1.20 28.28,110.91 30.1,109.09 30.1,106.72 J9.2 32.22,104.61 33.72,104.61 33.85,104.48 37.46,104.48 R57.2
D18
  Top 0.254: R67.2 35.01,106.3 34.73,106.58 33.24,106.58 J9.3 28.26,111.56 U$1.21
D19
  Top 0.254: U$1.22 30.61,112.21 J9.4 33.24,109.58 34.73,109.58 36.11,108.2 R76.2
D20
  Top 0.254: U$1.23 29.62,112.86 J9.5 32.8,114.53 33.85,115.58 34.72,115.58 R77.2
D21
  Top 0.254: R78.2 35.39,120.14 34.73,119.48 33.24,119.48 J9.6 28.7,114.94 28.7,114.59 27.62,113.51 U$1.24
D22
  Top 0.254: R79.2 32.68,121.92 J9.7 28.32,117.56 28.32,114.86 27.62,114.16 U$1.25
D23
  Top 0.254: R80.2 35.95,123.7 34.73,122.48 32.34,122.48 J9.8 30.82,123.53 27.94,120.65 27.94,115.13 27.62,114.81 U$1.26
D24
  Top 0.254: R81.2 6.35,102.53 J10.1 12.92,104.48 14.41,104.48 15.34,105.41 16.85,105.41 21.05,109.61 U$1.11
D25
  Top 0.254: R82.2 J10.2 12.48,105.53 17.21,110.26 U$1.10
D26
  Top 0.254: R83.2 6.37,108.53 J10.3 12.92,110.48 14.41,110.48 14.84,110.91 U$1.9
D27
  Top 0.254: R84.2 6.33,111.53 J10.4 12.48,111.53 13.53,112.58 14.41,112.58 15.43,111.56 U$1.8
D28
  Top 0.254: R68.2 10.87,114.43 J10.5 12.48,114.53 13.53,113.48 14.92,113.48 16.26,112.14 21.54,112.14 U$1.7
D29
  Top 0.254: R69.2 10.91,117.47 J10.6 12.92,115.58 14.41,115.58 17.13,112.86 U$1.6
D30
  Top 0.254: R70.2 6.45,120.53 J10.7 12.92,118.58 14.41,118.58 19.48,113.51 U$1.5
D31
  Top 0.254: R71.2 10.88,123.44 J10.8 12.92,121.58 14.41,121.58 15.02,120.97 15.02,120.29 21.15,114.16 U$1.4
D32
  Top 0.254: U$4.19 27.53,49.3 28.7,48.13 28.7,43.9 J11.1 32.55,41.57 33.6,42.62 36.28,42.62 R72.2
D33
  Top 0.254: U$4.20 27.52,49.95 29.21,48.26 29.21,46.4 J11.2 32.43,43.18 R73.2
D34
  Top 0.254: U$4.21 28,50.6 J11.3 32.55,47.57 33.6,46.52 35.95,46.52 R74.2
D35
  Top 0.254: U$4.22 26.96,51.31 30.3,51.31 J11.4 32.98,48.62 34.47,48.62 36.36,46.74 R75.2
D36
  Top 0.254: U$4.23 29.37,51.9 J11.5 32.55,53.57 33.6,54.62 34.6,54.62 R93.2
D37
  Top 0.254: U$4.24 27.36,52.55 28.45,53.63 28.45,53.98 J11.6 32.98,58.52 34.47,58.52 35.14,59.18 R94.2
D38
  Top 0.254: R95.2 37.38,60.71 32.17,60.71 J11.7 31.04,58.06 28.07,55.09 28.07,53.9 27.36,53.2 U$4.25
D39
  Top 0.254: R96.2 35.81,62.48 34.67,63.63 32.09,63.63 J11.8 31.04,61.06 27.68,57.71 27.68,54.17 27.36,53.85 U$4.26
D40
  Top 0.254: R85.2 6.35,41.57 J12.1 12.66,43.52 14.15,43.52 15.16,44.53 15.34,44.7 19.29,48.65 U$4.11
D41
  Top 0.254: R86.2 10.71,44.58 J12.2 12.66,46.52 14.15,46.52 15.52,47.88 17.98,47.88 19.4,49.3 U$4.10
D42
  Top 0.254: R87.2 10.66,47.62 J12.3 12.66,49.52 14.15,49.52 14.59,49.95 U$4.9
D43
  Top 0.254: R88.2 6.46,50.57 J12.4 12.22,50.57 13.28,51.62 14.15,51.62 15.18,50.6 U$4.8
D44
  Top 0.254: R89.2 10.69,53.59 J12.5 12.22,53.57 13.28,52.52 14.41,52.52 15.75,51.18 21.28,51.18 U$4.7
D45
  Top 0.254: R90.2 10.66,56.52 J12.6 12.22,56.57 13.28,55.52 14.84,55.52 18.46,51.9 U$4.6
D46
  Top 0.254: R91.2 10.71,59.56 J12.7 12.21,59.57 14.77,57.01 14.77,56.86 19.08,52.55 U$4.5
D47
  Top 0.254: R92.2 10.68,62.61 J12.8 12.66,60.62 14.15,60.62 14.77,60.01 14.77,59.33 20.9,53.2 U$4.4
D48
  Top 0.254: U$3.19 67.41,79.78 68.71,78.49 68.71,73.75 J1.1 71.92,72.05 72.97,71 76.11,71 R1.2
D49
  Top 0.254: U$3.20 67.4,80.43 69.09,78.74 69.09,76.37 J1.2 71.8,73.66 R10.2
D50
  Top 0.254: R11.2 74.64,75.31 73.84,76.1 72.35,76.1 J1.3 67.37,81.08 U$3.21
D51
  Top 0.254: R12.2 73,76.96 72.35,77.61 72.35,79.1 J1.4 67.94,81.05 67.43,81.56 66.45,81.56 U$3.22
D52
  Top 0.254: R13.2 74.07,85.21 71.56,85.21 J1.5 68.4,84.05 66.73,82.38 U$3.23
D53
  Top 0.254: U$3.24 66.73,83.03 69.73,86.03 69.73,86.38 J1.6 72.35,89 73.84,89 74.76,89.92 R14.2
D54
  Top 0.254: R15.2 76.77,91.21 71.56,91.21 70.82,90.47 | J1.7 70.82,90.47 | U$3.25 66.73,83.68 69.35,86.3 69.35,87.49 70.82,88.96 70.82,90.47
D55
  Top 0.254: R16.2 74.82,93.22 73.83,94.21 72.39,94.21 71.23,93.05 J1.8 69.45,93.05 67.08,90.67 67.08,84.68 66.73,84.33 U$3.26
D56
  Top 0.254: R17.2 46.1,72.05 J2.1 52.03,74 53.52,74 54.14,74.61 54.14,74.68 58.6,79.13 U$3.11
D57
  Top 0.254: R18.2 49.97,74.93 J2.2 51.59,75.05 56.33,79.78 U$3.10
D58
  Top 0.254: R2.2 50.01,77.98 J2.3 51.59,78.05 53.98,80.43 U$3.9
D59
  Top 0.254: R3.2 45.96,81.05 J2.4 51.14,82.1 53.52,82.1 54.55,81.08 U$3.8
D60
  Top 0.254: R4.2 50.06,84.07 J2.5 51.59,84.05 52.65,83 53.78,83 55.12,81.66 60.65,81.66 U$3.7
D61
  Top 0.254: R5.2 50.01,87.12 J2.6 51.59,87.05 52.65,86 53.7,86 57.4,82.3 60.64,82.3 U$3.6
D62
  Top 0.254: R6.2 J2.7 51.59,90.05 58.61,83.03 U$3.5
D63
  Top 0.254: R7.2 50.05,93.09 J2.8 52.03,91.1 53.52,91.1 54.14,90.49 54.14,89.81 60.27,83.68 U$3.4
D64
  Top 0.254: U$6.19 26.95,18.78 27.54,18.78 28.45,17.87 28.45,13.68 J3.1 32.09,10.04 34.47,10.04 35.1,10.67 R8.2
D65
  Top 0.254: R9.2 37.04,12.91 32.22,12.91 J3.2 29.35,15.78 29.35,18.15 28.03,19.47 U$6.20
D66
  Top 0.254: U$6.21 28,20.12 J3.3 32.38,17.09 34.33,15.14 34.47,15.14 35.39,14.22 R19.2
D67
  Top 0.254: R28.2 34.47,19.04 33.6,19.04 32.55,20.09 J3.4 30.35,20.77 U$6.22
D68
  Top 0.254: U$6.23 29.21,21.42 30.88,23.09 J3.5 32.25,24.3 35.13,24.3 R29.2
D69
  Top 0.254: U$6.24 28.17,22.07 29.59,23.5 29.59,24.64 J3.6 32.98,28.04 34.47,28.04 34.88,28.45 R30.2
D70
  Top 0.254: R31.2 34.54,30.23 34.29,30.48 32.43,30.48 J3.7 31.04,27.58 28.07,24.61 28.07,23.42 27.54,22.89 27.08,22.89 U$6.25
D71
  Top 0.254: U$6.26 27.08,23.54 27.54,23.54 27.68,23.69 27.68,27.23 31.04,30.58 J3.8 32.06,33.12 32.09,33.14 36.36,33.14 R32.2
D72
  Top 0.254: R33.2 10.68,11.05 J4.1 12.22,11.09 19.26,18.13 21.31,18.13 U$6.11
D73
  Top 0.254: R34.2 10.71,14.1 J4.2 12.22,14.09 16.91,18.78 21.31,18.78 U$6.10
D74
  Top 0.254: R35.2 10.66,17.14 J4.3 12.66,19.04 14.15,19.04 14.59,19.47 U$6.9
D75
  Top 0.254: R36.2 10.69,20.07 J4.4 11.77,21.14 14.15,21.14 15.18,20.12 15.24,20.12 U$6.8
D76
  Top 0.254: U$6.7 21.28,20.7 15.62,20.7 14.29,22.04 11.77,22.04 J4.5 6.33,23.09 R20.2
D77
  Top 0.254: R21.2 10.66,26.04 J4.6 12.22,26.09 13.28,25.04 14.08,25.04 17.78,21.34 21.27,21.34 U$6.6
D78
  Top 0.254: R22.2 10.71,29.08 J4.7 12.66,27.14 14.15,27.14 19.23,22.07 U$6.5
D79
  Top 0.254: R23.2 10.68,32.13 J4.8 12.66,30.14 14.15,30.14 14.77,29.53 14.77,28.85 20.9,22.72 U$6.4
D80
  Top 0.254: R24.2 74.73,102.36 73.84,101.48 71.46,101.48 J5.1 68.71,104.23 68.71,108.84 67.28,110.26 U$5.19
D81
  Top 0.254: R25.2 71.8,104.14 J5.2 69.22,106.72 69.22,109.09 67.4,110.91 U$5.20
D82
  Top 0.254: R26.2 74.51,105.92 73.84,106.58 72.35,106.58 J5.3 67.37,111.56 U$5.21
D83
  Top 0.254: R27.2 74.06,107.7 73.84,107.48 72.97,107.48 72.35,108.09 72.35,109.58 J5.4 69.67,112.27 66.33,112.27 U$5.22
D84
  Top 0.254: R45.2 74.6,115.58 72.97,115.58 71.92,114.53 J5.5 68.74,112.86 U$5.23
D85
  Top 0.254: R46.2 74.25,119.89 73.84,119.48 72.35,119.48 J5.6 67.82,114.94 67.82,114.59 66.73,113.51 U$5.24
D86
  Top 0.254: R47.2 71.54,121.67 J5.7 70.41,119.02 67.44,116.05 67.44,114.86 66.73,114.16 U$5.25
D87
  Top 0.254: R48.2 75.73,124.84 71.72,124.84 J5.8 70.41,122.02 67.05,118.67 67.05,115.13 66.73,114.81 U$5.26
D88
  Top 0.254: R37.2 45.98,102.53 J6.1 52.03,104.48 53.52,104.48 58.66,109.61 U$5.11
D89
  Top 0.254: R38.2 46.05,105.53 J6.2 52.03,107.48 53.52,107.48 56.31,110.26 U$5.10
D90
  Top 0.254: R39.2 50.03,108.58 J6.3 52.03,110.48 53.52,110.48 53.96,110.91 U$5.9
D91
  Top 0.254: U$5.8 60.67,111.51 54.61,111.51 53.53,112.58 52.65,112.58 51.59,111.53 J6.4 45.96,111.53 R40.2
D92
  Top 0.254: R41.2 50.06,114.55 J6.5 51.59,114.53 52.65,113.48 53.78,113.48 55.12,112.14 60.65,112.14 U$5.7
D93
  Top 0.254: U$5.6 60.64,112.78 57.28,112.78 53.58,116.48 51.14,116.48 J6.6 50.03,117.47 R42.2
D94
  Top 0.254: R43.2 J6.7 | J6.7 | J6.7 52.02,118.58 53.52,118.58 58.59,113.51 U$5.5
D95
  Top 0.254: U$5.4 60.27,114.16 54.14,120.29 54.14,120.97 51.58,123.53 J6.8 45.98,123.53 R44.2
GND  (via drill 0.35, 0.36, 1)
  Top 0.254: U$4.12 20.06,48 v19.05,46.99 | U$3.12 59.43,78.48 v58.42,77.47 | U$5.12 59.43,108.96 v58.42,107.95 | U$6.27 26.86,24.07 26.4,24.07 25.93,24.53 25.93,26.54 v26.06,26.67 | U$6.12 20.06,17.52 v19.05,16.51 | U$2.27 26.45,84.98 26.06,85.37 v26.06,87.63 | v19.05,76.2 20.58,77.73 20.58,78.16 20.9,78.48 U$2.12 | v19.05,106.68 19.05,106.86 21.15,108.96 U$1.12 | U$3.27 65.82,84.98 65.5,85.3 65.5,85.96 66.04,86.51 v66.04,87.63 | v64.77,118.11 64.77,116.51 65.82,115.46 U$5.27 | U$4.27 26.45,54.5 26.04,54.91 26.04,56.42 v26.13,56.52 | C6.2 60.21,89.42 v59.69,88.9 | C3.2 24.64,118.87 v25.4,118.11 25.4,116.76 26.7,115.46 U$1.27 | C1.2 20.84,92.19 v20.32,92.71 | C4.2 20.32,61.61 v20.32,63.5 | C2.2 20.32,31 v20.32,33.02 | C5.2 61.48,119.9 v62.99,121.41
  Top 0.813: J14.2 75.57,51.59 D2.A 78.74,56.38 v78.74,57.15 | C7.1 74.54,15.11 v74.93,15.11
  pour Bottom: 0,0 0,129.29 arc-90 2.54,131.83 89.15,131.83 arc-90 91.69,129.29 91.69,2.67 arc-90 89.15,0.13 0.13,0.13
N$1
  Top 0.813: J14.1 82.78,49.24 D1.A
N$3
  Top 0.813: D1.C 82.75,54.92 XF1.1 | D1.C 86.16,54.92 XF1.2 | D2.C D1.C
S0  (via drill 0.35)
  Top 0.254: v23.58,18.29 v23.58,43.31 23.58,44.45 23.83,44.7 23.83,45.39 26.4,47.96 26.86,47.96 U$4.17 | v23.58,48.77 v23.58,74.04 23.58,75.62 26.45,78.48 U$2.17 | v23.58,79.25 23.58,106.51 26.03,108.96 U$1.17 | U$6.17 26.86,17.48 26.4,17.48 23.83,14.91 23.83,12.44 v23.58,12.19 23.58,6.72 28.93,1.37 62.33,1.37 63.5,2.54 63.5,7.87 66.04,10.41 A1.D2 63.5,13.97 63.5,48.09 62.48,49.11 62.48,49.95 63.21,50.67 v63.21,72.64 63.21,76.32 65.37,78.48 U$3.17 | U$5.17 65.82,108.96 63.21,106.35 v63.21,79.25
  Bottom 0.254: v23.58,18.29 v23.58,12.19 | v23.58,43.31 v23.58,48.77 | v23.58,74.04 v23.58,79.25 | v63.21,72.64 v63.21,79.25
S1  (via drill 0.35)
  Top 0.254: v62.23,11.43 62.23,3.94 60.07,1.78 30.1,1.78 24.38,7.49 24.38,12.97 v24.49,13.08 24.74,13.33 24.74,15.17 26.4,16.83 26.86,16.83 U$6.16 | v24.49,19.05 24.49,44.43 24.51,44.45 v24.49,44.45 24.74,44.7 24.74,45.65 26.53,47.44 26.82,47.44 U$4.16 | A1.D3 64.64,15.37 64.64,73.26 v64.24,73.66 64.24,76.81 65.26,77.83 U$3.16 | v24.49,49.53 24.49,74.78 24.51,74.8 v24.49,74.8 24.49,75.88 26.45,77.83 U$2.16 | v24.49,80.01 24.49,106.1 26.7,108.31 U$1.16 | v64.11,80.01 64.11,106.61 65.82,108.31 U$5.16
  Bottom 0.254: v64.24,73.66 64.24,79.88 v64.11,80.01 | A1.D3 63.5,11.43 v62.23,11.43 | v24.49,19.05 v24.49,13.08 | v24.49,44.45 24.49,49.51 24.51,49.53 v24.49,49.53 | v24.49,74.8 24.49,79.99 24.51,80.01 v24.49,80.01
S2  (via drill 0.35)
  Top 0.254: v65.02,80.77 65.02,106.41 U$5.15 | v60.96,12.7 60.96,4.24 58.88,2.16 32.13,2.16 25.4,8.89 v25.4,13.97 26.91,15.47 U$6.15 | v25.4,19.81 v25.4,45.21 25.41,45.21 U$4.15 | A1.D4 65.02,17.53 v65.02,74.55 65.02,75.93 U$3.15 | v25.4,50.29 v25.4,75.56 26.91,77.07 U$2.15 | v25.4,80.77 25.4,105.9 U$1.15
  Bottom 0.254: v65.02,74.55 v65.02,80.77 | A1.D4 62.23,12.7 v60.96,12.7 | v25.4,13.97 v25.4,19.81 | v25.4,45.21 v25.4,50.29 | v25.4,75.56 v25.4,80.77

### Text on the board
tPlace: HyTech Racing 2024 / Thermistor Expansion Module / Designed by Rajan Sandhu